# EAGLE design STM32_learning stand (EAGLE 9.5.2)

## Sheet 1 of 2: Питание, микроконтроллер, цифровой и аналоговый ввод, системы измерения
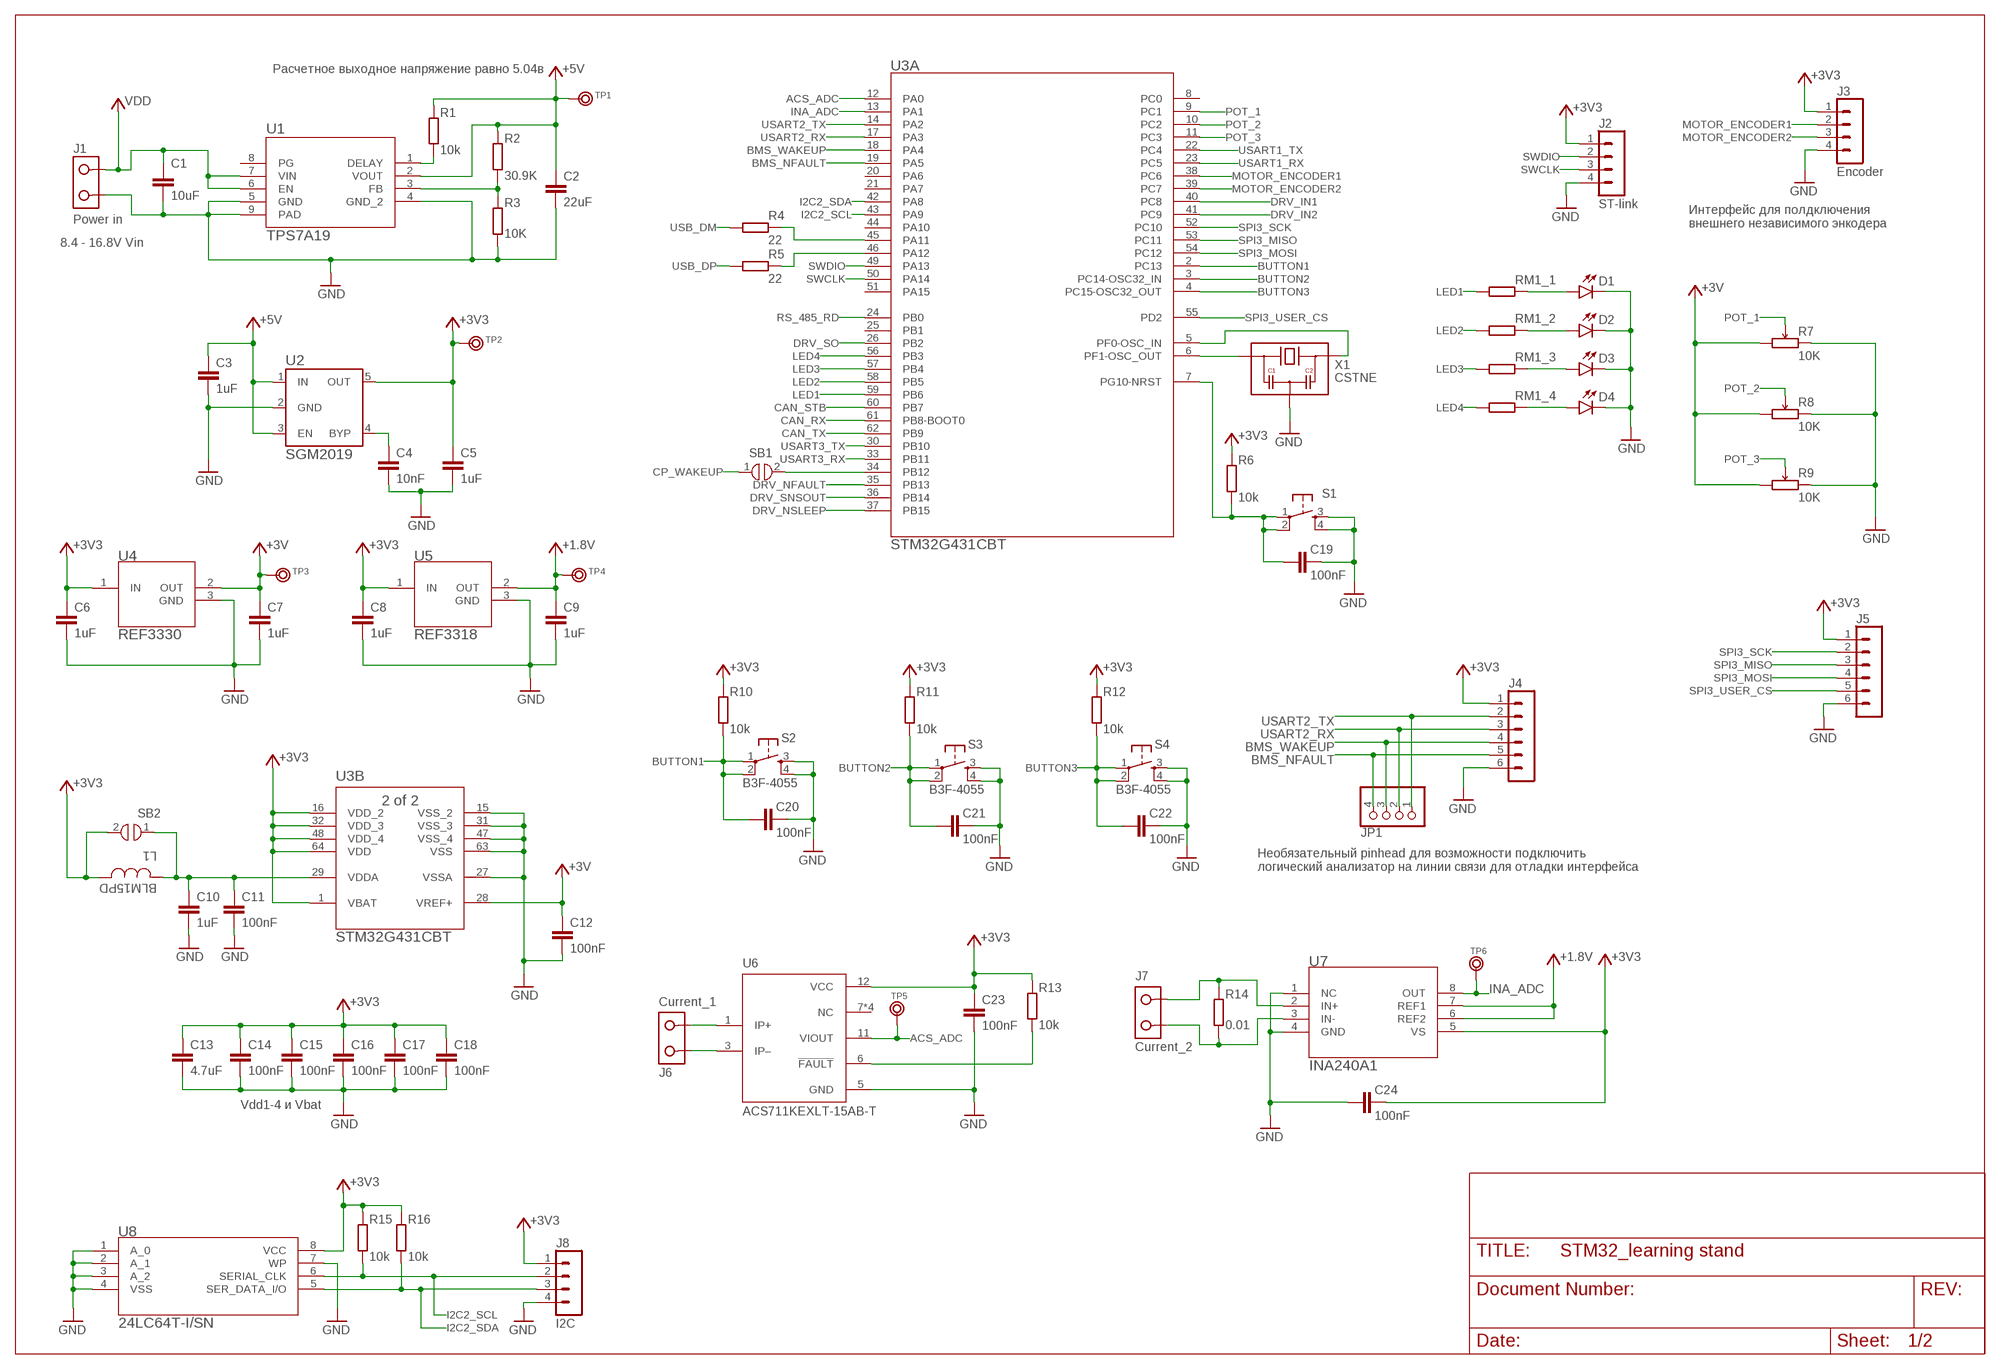
[diagram p0: schematic, sheet 1]

### Parts
C1  10uF  C-EU1206  [C1206]
C2  22uF  C-EU0805  [C0805]
C3  1uF  C-EU0603  [C0603]
C4  10nF  C-EU0402  [C0402]
C5  1uF  C-EU0603  [C0603]
C6  1uF  C-EU0603  [C0603]
C7  1uF  C-EU0603  [C0603]
C8  1uF  C-EU0603  [C0603]
C9  1uF  C-EU0603  [C0603]
C10  1uF  C-EU0603  [C0603]
C11  100nF  C-EU0402  [C0402]
C12  100nF  C-EU0402  [C0402]
C13  4.7uF  C-EU0603  [C0603]
C14  100nF  C-EU0402  [C0402]
C15  100nF  C-EU0402  [C0402]
C16  100nF  C-EU0402  [C0402]
C17  100nF  C-EU0402  [C0402]
C18  100nF  C-EU0402  [C0402]
C19  100nF  C-EU0402  [C0402]
C20  100nF  C-EU0402  [C0402]
C21  100nF  C-EU0402  [C0402]
C22  100nF  C-EU0402  [C0402]
C23  100nF  C-EU0402  [C0402]
C24  100nF  C-EU0402  [C0402]
D1  Blue  LED0805  [LED-0805]
D2  Blue  LED0805  [LED-0805]
D3  Blue  LED0805  [LED-0805]
D4  Blue  LED0805  [LED-0805]
J1  Power in  DG301-2P"  [DG301-2P]
J2  ST-link  S4B-PH-K  [S4B-PH-K]
J3  Encoder  S4B-PH-K  [S4B-PH-K]
J4  BMS_interface  S6B-PH-K  [S6B-PH-K]
J5  S6B-PH-K  [S6B-PH-K]
J6  Current_1  DG301-2P"  [DG301-2P]
J7  Current_2  DG301-2P"  [DG301-2P]
J8  I2C  B4B-PH-K  [B4B-PH-K]
JP1  PINHD-1X4  [1X04]
L1  BLM15PD  0402  [0402]
R1  10k  R-EU0402  [R0402]
R2  30.9K  R-EU0603  [R0603]
R3  10K  R-EU0603  [R0603]
R4  22  R-EU0402  [R0402]
R5  22  R-EU0402  [R0402]
R6  10k  R-EU0402  [R0402]
R7  10K  POTEMTIOMETER_EU  [ALPS_PTM]
R8  10K  POTEMTIOMETER_EU  [ALPS_PTM]
R9  10K  POTEMTIOMETER_EU  [ALPS_PTM]
R10  10k  R-EU0402  [R0402]
R11  10k  R-EU0402  [R0402]
R12  10k  R-EU0402  [R0402]
R13  10k  R-EU0402  [R0402]
R14  0.01  R_EU_CS  [CS_R0805]
R15  10k  R-EU0402  [R0402]
R16  10k  R-EU0402  [R0402]
RM1  RES_ARRAY  [0603-ARC]
S1  MOMENTARY-SWITCH-SPST-2-[SMD-5.2MM]  [TACTILE_SWITCH_SMD_5.2MM]
S2  B3F-4055  [SWITCH_B3F-4055]
S3  B3F-4055  [SWITCH_B3F-4055]
S4  B3F-4055  [SWITCH_B3F-4055]
SB1  SOLDER_BRIDGE  [SOLDER_BRIDGE]
SB2  SOLDER_BRIDGE  [SOLDER_BRIDGE]
TP1  TEST_RING  [TEST_RING]
TP2  TEST_RING  [TEST_RING]
TP3  TEST_RING  [TEST_RING]
TP4  TEST_RING  [TEST_RING]
TP5  TEST_RING  [TEST_RING]
TP6  TEST_RING  [TEST_RING]
U1  TPS7A19  TPS7A1901DRBT  [DRB0008B]
U2  SGM2019  [SOT23-5]
U3  STM32G431CBT  STM32G4_LQFP64  [LQFP64-10X10MM]
U4  REF3330  REF33  [SOT-23-3]
U5  REF3318  REF33  [SOT-23-3]
U6  ACS711KEXLT-15AB-T  [SENSOR_ACS711KEXLT-15AB-T]
U7  INA240A1  INA240_TSSOP  [TSSOP-8]
U8  24LC64T-I/SN  SOIC8_I2C_SMALL  [SOIC8]
X1  CSTNE  [MURATA_SMD_3P]

### Nets
+1.8V: C9.2 TP4.1 U5.2(OUT) U7.6(REF2) U7.7(REF1)
+3V: C7.2 C12.1 R7.P$1 R8.P$1 R9.P$1 TP3.1 U3.28(B:VREF+) U4.2(OUT)
+3V3: C5.2 C6.2 C8.2 C13.2 C14.1 C15.1 C16.1 C17.1 C18.1 C23.1 C24.2 J2.1 J3.1 J4.1 J5.1 J8.1 L1.2 R6.2 R10.2 R11.2 R12.2 R13.2 R15.2 R16.2 SB2.2 TP2.1 U2.5(OUT) U3.1(B:VBAT) U3.16(B:VDD_2) U3.32(B:VDD_3) U3.48(B:VDD_4) U3.64(B:VDD) U4.1(IN) U5.1(IN) U6.12(VCC) U7.5(VS) U8.8(VCC) ; also sheet 2
+5V: C2.1 C3.2 R1.2 R2.2 TP1.1 U1.2(VOUT) U2.1(IN) U2.3(EN) ; also sheet 2
ACS_ADC: TP5.1 U3.12(A:PA0) U6.11(VIOUT)
ACS_IP+: J6.1 U6.1(IP+)
ACS_IP-: J6.2 U6.3(IP–)
BMS_NFAULT: J4.5 JP1.4 U3.19(A:PA5)
BMS_WAKEUP: J4.4 JP1.3 U3.18(A:PA4)
BUTTON1: C20.1 R10.1 S2.1 S2.2 U3.2(A:PC13)
BUTTON2: C21.1 R11.1 S3.1 S3.2 U3.3(A:PC14-OSC32_IN)
BUTTON3: C22.1 R12.1 S4.1 S4.2 U3.4(A:PC15-OSC32_OUT)
CAN_RX: U3.61(A:PB8-BOOT0) ; also sheet 2
CAN_STB: U3.60(A:PB7) ; also sheet 2
CAN_TX: U3.62(A:PB9) ; also sheet 2
CP_WAKEUP: SB1.1 ; also sheet 2
DRV_IN1: U3.40(A:PC8) ; also sheet 2
DRV_IN2: U3.41(A:PC9) ; also sheet 2
DRV_NFAULT: U3.35(A:PB13) ; also sheet 2
DRV_NSLEEP: U3.37(A:PB15) ; also sheet 2
DRV_SNSOUT: U3.36(A:PB14) ; also sheet 2
DRV_SO: U3.26(A:PB2) ; also sheet 2
GND: C1.2 C2.2 C3.1 C4.2 C5.1 C6.1 C7.1 C8.1 C9.1 C10.1 C11.2 C12.2 C13.1 C14.2 C15.2 C16.2 C17.2 C18.2 C19.2 C20.2 C21.2 C22.2 C23.2 C24.1 D1.-(C) D2.-(C) D3.-(C) D4.-(C) J1.1 J2.4 J3.4 J4.6 J5.6 J8.4 R3.1 R7.P$3 R8.P$3 R9.P$3 S1.3 S1.4 S2.3 S2.4 S3.3 S3.4 S4.3 S4.4 U1.4(GND_2) U1.5(GND) U1.9(PAD) U2.2(GND) U3.15(B:VSS_2) U3.27(B:VSSA) U3.31(B:VSS_3) U3.47(B:VSS_4) U3.63(B:VSS) U4.3(GND) U5.3(GND) U6.5(GND) U7.1(NC) U7.4(GND) U8.1(A_0) U8.2(A_1) U8.3(A_2) U8.4(VSS) U8.7(WP) X1.2(GND) ; also sheet 2
I2C2_SCL: J8.2 R15.1 U3.43(A:PA9) U8.6(SERIAL_CLK)
I2C2_SDA: J8.3 R16.1 U3.42(A:PA8) U8.5(SER_DATA_I/O)
INA_ADC: TP6.1 U3.13(A:PA1) U7.8(OUT)
LED1: RM1.1 U3.59(A:PB6)
LED2: RM1.2 U3.58(A:PB5)
LED3: RM1.3 U3.57(A:PB4)
LED4: RM1.4 U3.56(A:PB3)
MOTOR_ENCODER1: J3.2 U3.38(A:PC6)
MOTOR_ENCODER2: J3.3 U3.39(A:PC7)
N$2: D4.+(A) RM1.5
N$3: SB1.2 U3.34(A:PB12)
N$4: C4.1 U2.4(BYP)
N$9: D3.+(A) RM1.6
N$12: R4.2 U3.45(A:PA11)
N$13: R5.2 U3.46(A:PA12)
N$14: D2.+(A) RM1.7
N$15: D1.+(A) RM1.8
N$16: U3.6(A:PF1-OSC_OUT) X1.1(IN)
N$17: U3.5(A:PF0-OSC_IN) X1.3(OUT)
N$18: C19.1 R6.1 S1.1 S1.2 U3.7(A:PG10-NRST)
N$21: R2.1 R3.2 U1.3(FB)
N$22: R1.1 U1.1(DELAY)
N$23: R13.1 U6.6(!FAULT)
N$25: J7.1 R14.2 U7.2(IN+)
N$28: J7.2 R14.1 U7.3(IN-)
POT_1: R7.P$2 U3.9(A:PC1)
POT_2: R8.P$2 U3.10(A:PC2)
POT_3: R9.P$2 U3.11(A:PC3)
RS_485_RD: U3.24(A:PB0) ; also sheet 2
SPI3_MISO: J5.3 U3.53(A:PC11)
SPI3_MOSI: J5.4 U3.54(A:PC12)
SPI3_SCK: J5.2 U3.52(A:PC10)
SPI3_USER_CS: J5.5 U3.55(A:PD2)
SWCLK: J2.3 U3.50(A:PA14)
SWDIO: J2.2 U3.49(A:PA13)
USART1_RX: U3.23(A:PC5) ; also sheet 2
USART1_TX: U3.22(A:PC4) ; also sheet 2
USART2_RX: J4.3 JP1.2 U3.17(A:PA3)
USART2_TX: J4.2 JP1.1 U3.14(A:PA2)
USART3_RX: U3.33(A:PB11) ; also sheet 2
USART3_TX: U3.30(A:PB10) ; also sheet 2
USB_DM: R4.1 ; also sheet 2
USB_DP: R5.1 ; also sheet 2
VDD: C1.1 J1.2 U1.6(EN) U1.7(VIN) ; also sheet 2
VDDA: C10.2 C11.1 L1.1 SB2.1 U3.29(B:VDDA)
Unconnected: U1.8(PG) U3.8(A:PC0) U3.20(A:PA6) U3.21(A:PA7) U3.25(A:PB1) U3.44(A:PA10) U3.51(A:PA15) U6.7(NC) U6.8(NC) U6.9(NC) U6.10(NC)

### Notes on the sheet
- Расчетное выходное напряжение равно 5.04в
- Интерфейс для полдключения
  внешнего независимого энкодера
- 8.4 - 16.8V Vin
- Необязательный pinhead для возможности подключить
  логический анализатор на линии связи для отладки интерфейса
- Vdd1-4 и Vbat

## Sheet 2 of 2: Интерфейсы связи и драйвер двигателя
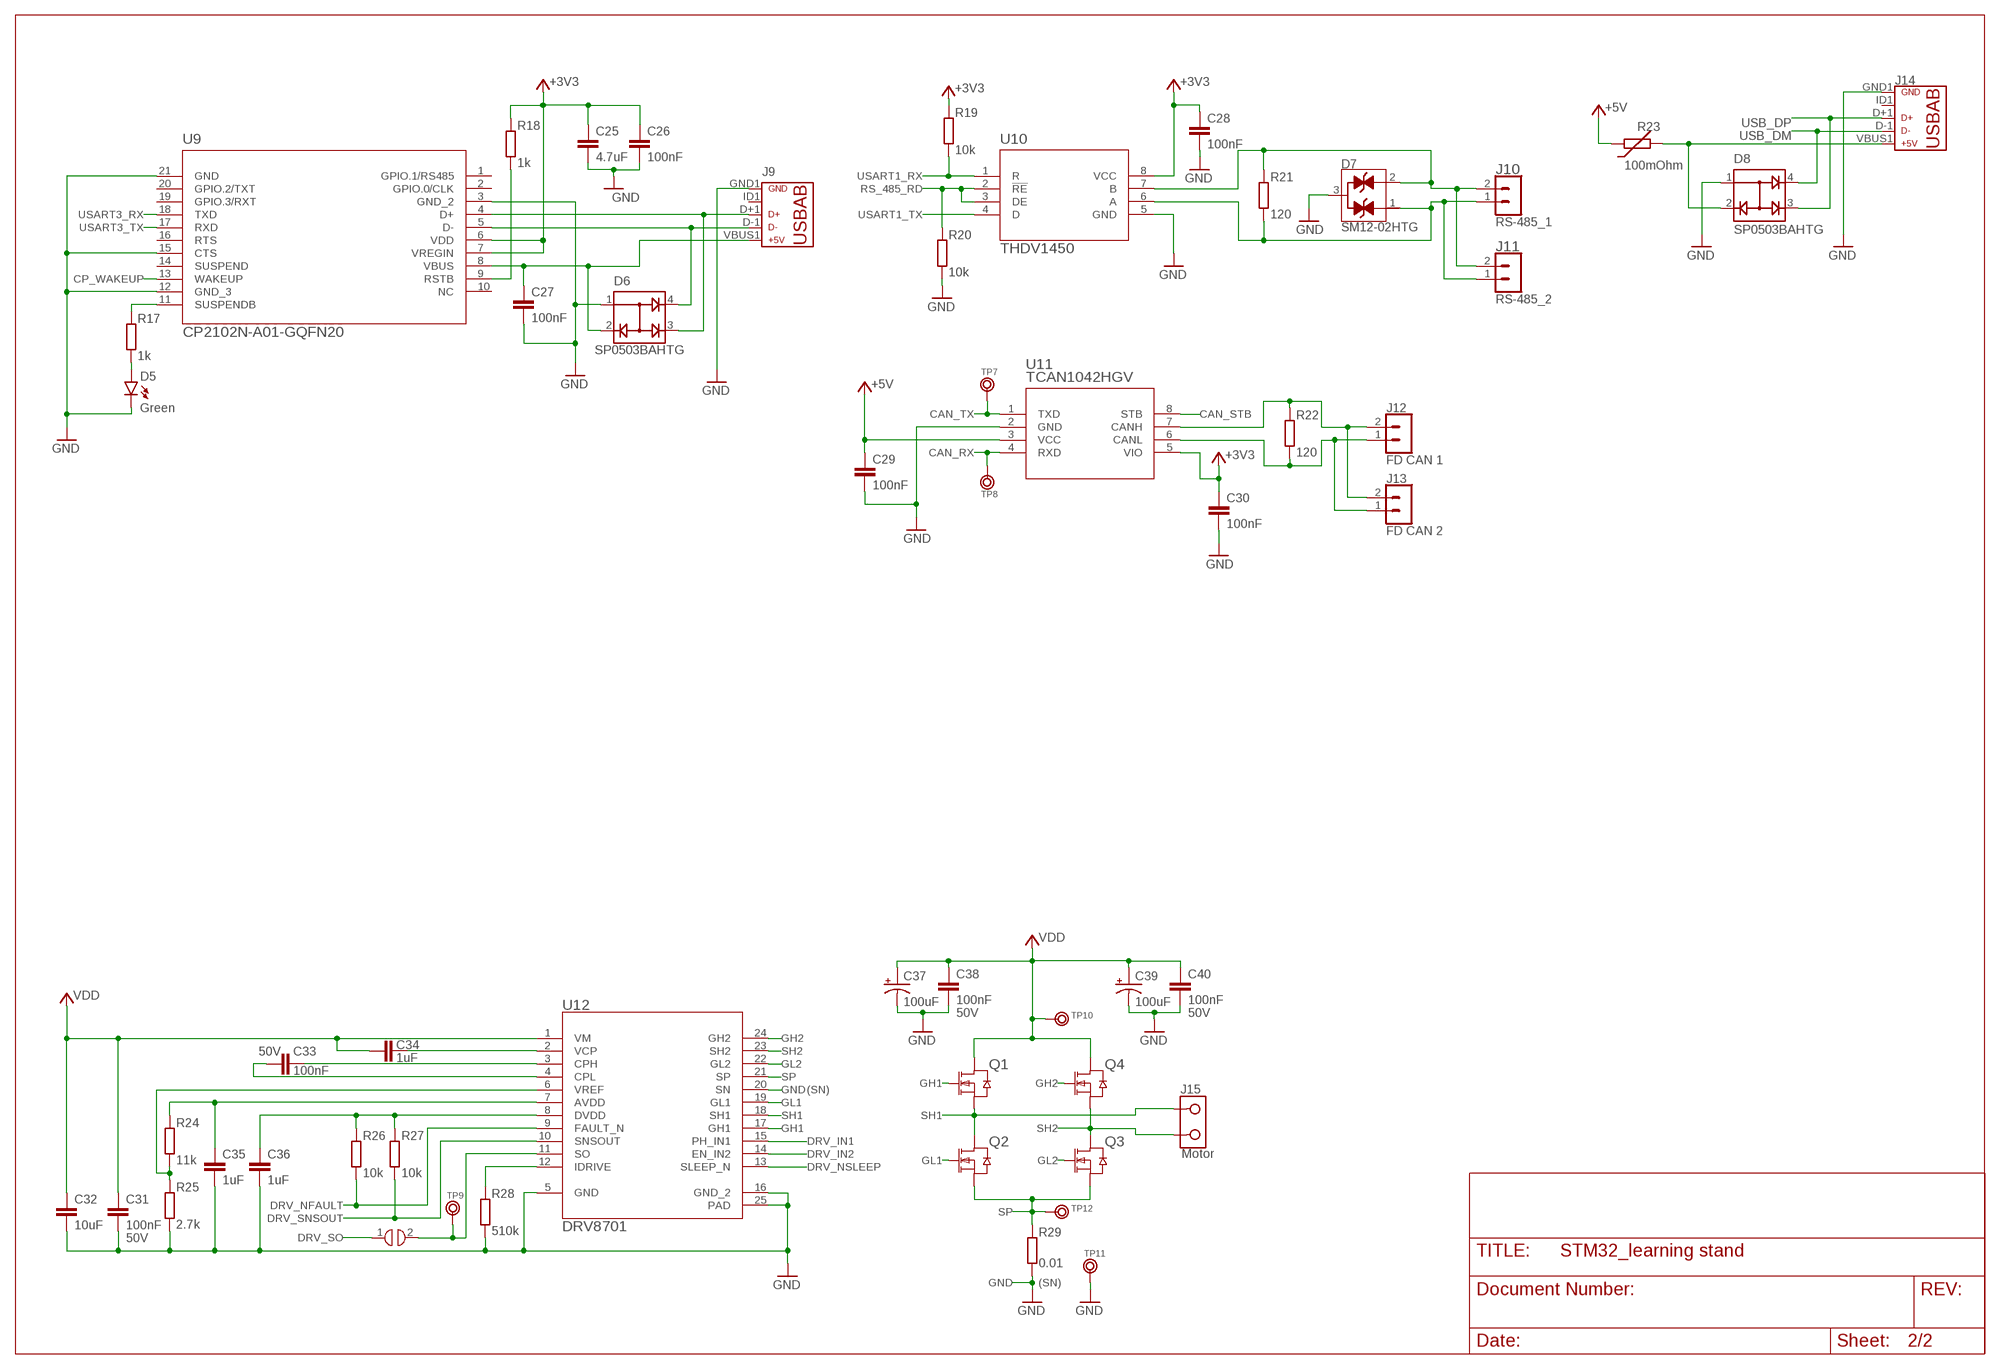
[diagram p1: schematic, sheet 2]

### Parts
C25  4.7uF  C-EU0603  [C0603]
C26  100nF  C-EU0402  [C0402]
C27  100nF  C-EU0402  [C0402]
C28  100nF  C-EU0402  [C0402]
C29  100nF  C-EU0402  [C0402]
C30  100nF  C-EU0402  [C0402]
C31  100nF  C-EU-CERAMIC0603  [C0603]
C32  10uF  C-EU1206  [C1206]
C33  100nF  C-EU-CERAMIC0603  [C0603]
C34  1uF  C-EU0603  [C0603]
C35  1uF  C-EU0603  [C0603]
C36  1uF  C-EU0603  [C0603]
C37  100uF  C-EU-ELECTROLYTIC-6.3X7.7  [6.3X7.7]
C38  100nF  C-EU-CERAMIC0603  [C0603]
C39  100uF  C-EU-ELECTROLYTIC-6.3X7.7  [6.3X7.7]
C40  100nF  C-EU-CERAMIC0603  [C0603]
D5  Green  LED0805  [LED-0805]
D6  SP0503BAHTG  [SOT143]
D7  SM12-02HTG  SOT_23_TVS  [SOT23]
D8  SP0503BAHTG  [SOT143]
J9  USB_MICRO""  [USB-MICRO-SMD]
J10  RS-485_1  S2B-PH-K  [S2B-PH-K]
J11  RS-485_2  S2B-PH-K  [S2B-PH-K]
J12  FD CAN 1  S2B-PH-K  [S2B-PH-K]
J13  FD CAN 2  S2B-PH-K  [S2B-PH-K]
J14  USB_MICRO""  [USB-MICRO-SMD]
J15  Motor  DG301-2P"  [DG301-2P]
Q1  SON5X6_MOSFET  [SON5X6]
Q2  SON5X6_MOSFET  [SON5X6]
Q3  SON5X6_MOSFET  [SON5X6]
Q4  SON5X6_MOSFET  [SON5X6]
R17  1k  R-EU0402  [R0402]
R18  1k  R-EU0402  [R0402]
R19  10k  R-EU0402  [R0402]
R20  10k  R-EU0402  [R0402]
R21  120  R-EU0805  [R0805]
R22  120  R-EU0805  [R0805]
R23  100mOhm  PTC_FUSE-0805  [0805_PTC_FUSE]
R24  11k  R-EU0402  [R0402]
R25  2.7k  R-EU0402  [R0402]
R26  10k  R-EU0402  [R0402]
R27  10k  R-EU0402  [R0402]
R28  510k  R-EU0402  [R0402]
R29  0.01  R_EU_CS  [CS_R0805]
SB3  SOLDER_BRIDGE  [SOLDER_BRIDGE]
TP7  TEST_RING  [TEST_RING]
TP8  TEST_RING  [TEST_RING]
TP9  TEST_RING  [TEST_RING]
TP10  TEST_RING  [TEST_RING]
TP11  TEST_RING  [TEST_RING]
TP12  TEST_RING  [TEST_RING]
U9  CP2102N-A01-GQFN20  [QFN20C_3X3]
U10  THDV1450  RS485_S8  [SOIC8]
U11  TCAN1042HGV  8_PIN_CAN_TRANSIVERSTB_VIO  [SOIC_8]
U12  DRV8701  [VQFN-24]

### Nets
+3V3: C25.2 C26.1 C28.1 C30.1 R18.2 R19.2 U9.6(VDD) U9.7(VREGIN) U10.8(VCC) U11.5(VIO) ; also sheet 1
+5V: C29.1 R23.1 U11.3(VCC) ; also sheet 1
CAN_RX: TP8.1 U11.4(RXD) ; also sheet 1
CAN_STB: U11.8(STB) ; also sheet 1
CAN_TX: TP7.1 U11.1(TXD) ; also sheet 1
CANH: J12.2 J13.2 R22.1 U11.7(CANH)
CANL: J12.1 J13.1 R22.2 U11.6(CANL)
CP_WAKEUP: U9.13(WAKEUP) ; also sheet 1
DRV_IN1: U12.15(PH_IN1) ; also sheet 1
DRV_IN2: U12.14(EN_IN2) ; also sheet 1
DRV_NFAULT: R26.1 U12.9(FAULT_N) ; also sheet 1
DRV_NSLEEP: U12.13(SLEEP_N) ; also sheet 1
DRV_SNSOUT: R27.1 U12.10(SNSOUT) ; also sheet 1
DRV_SO: SB3.1 ; also sheet 1
GH1: Q1.4(G) U12.17(GH1)
GH2: Q4.4(G) U12.24(GH2)
GL1: Q2.4(G) U12.19(GL1)
GL2: Q3.4(G) U12.22(GL2)
GND: C25.1 C26.2 C27.2 C28.2 C29.2 C30.2 C31.2 C32.2 C35.1 C36.1 C37.2(-) C38.2 C39.2(-) C40.2 D5.-(C) D6.1 D7.3 D8.1 J9.GND1(GND) J14.GND1(GND) R20.1 R25.1 R28.1 R29.1 TP11.1 U9.3(GND_2) U9.12(GND_3) U9.15(CTS) U9.21(GND) U10.5(GND) U11.2(GND) U12.5(GND) U12.16(GND_2) U12.20(SN) U12.25(PAD) ; also sheet 1
N$1: D6.3 J9.D+1(D+) U9.4(D+)
N$5: D6.4 J9.D-1(D-) U9.5(D-)
N$6: C27.1 D6.2 J9.VBUS1(VBUS) U9.8(VBUS)
N$7: R17.2 U9.11(SUSPENDB)
N$8: R18.1 U9.9(RSTB)
N$10: D5.+(A) R17.1
N$11: D8.2 J14.VBUS1(VBUS) R23.2
N$19: D7.2 J10.2 J11.2 R21.2 U10.7(B)
N$20: D7.1 J10.1 J11.1 R21.1 U10.6(A)
N$24: C33.1 U12.3(CPH)
N$29: SB3.2 TP9.1 U12.11(SO)
N$32: C33.2 U12.4(CPL)
N$33: C34.2 U12.2(VCP)
N$34: R24.1 R25.2 U12.6(VREF)
N$35: C35.2 R24.2 U12.7(AVDD)
N$36: C36.2 R26.2 R27.2 U12.8(DVDD)
N$37: R28.2 U12.12(IDRIVE)
RS_485_RD: R20.2 U10.2(!RE) U10.3(DE) ; also sheet 1
SH1: J15.1 Q1.1(S) Q1.2(S) Q1.3(S) Q2.5(D) Q2.6(D) Q2.7(D) Q2.8(D) Q2.9(D) U12.18(SH1)
SH2: J15.2 Q3.5(D) Q3.6(D) Q3.7(D) Q3.8(D) Q3.9(D) Q4.1(S) Q4.2(S) Q4.3(S) U12.23(SH2)
SP: Q2.1(S) Q2.2(S) Q2.3(S) Q3.1(S) Q3.2(S) Q3.3(S) R29.2 TP12.1 U12.21(SP)
USART1_RX: R19.1 U10.1(R) ; also sheet 1
USART1_TX: U10.4(D) ; also sheet 1
USART3_RX: U9.18(TXD) ; also sheet 1
USART3_TX: U9.17(RXD) ; also sheet 1
USB_DM: D8.4 J14.D-1(D-) ; also sheet 1
USB_DP: D8.3 J14.D+1(D+) ; also sheet 1
VDD: C31.1 C32.1 C34.1 C37.1(+) C38.1 C39.1(+) C40.1 Q1.5(D) Q1.6(D) Q1.7(D) Q1.8(D) Q1.9(D) Q4.5(D) Q4.6(D) Q4.7(D) Q4.8(D) Q4.9(D) TP10.1 U12.1(VM) ; also sheet 1
Unconnected: J9.ID1(USBID) J14.ID1(USBID) U9.1(GPIO.1/RS485) U9.2(GPIO.0/CLK) U9.10(NC) U9.14(SUSPEND) U9.16(RTS) U9.19(GPIO.3/RXT) U9.20(GPIO.2/TXT)

### Notes on the sheet
- 50V | 50V
- 50V
- (SN)
- 50V
- (SN)

## Library data of the parts
C1-C30 C32 C34-C36 = Capacitors:C-EU
C31 C33 C38 C40 = Capacitors:C-EU-CERAMIC
C37 C39 = Capacitors:C-EU-ELECTROLYTIC; BUILT_BY: EMA_Cory; COPYRIGHT: Copyright (C) 2018 Accelerated Designs. All rights reserved; MANUFACTURER_PART_NUMBER: EEE-1VA100WAR; VENDOR: Panasonic
D1-D5 = Semiconductor_devices:LED0805: LED Model suitable for all 0805 leds Updated: 22.10.19 by Andrey Dovnar, andrevdovnar@gmail.com
D6 D8 = Semiconductor_devices:SP0503BAHTG: TVS DIODE 5.5VWM 8.5VC SOT143 Model suitable for SP0503BAHTG Updated: 30.01.20 by Andrey Dovnar, andrevdovnar@gmail.com; DESCRIPTION: 8.5V Clamp Ipp Tvs Diode Surface Mount SOT-143-4; DIGI-KEY_PART_NUMBER: F2715CT-ND; DIGI-KEY_PURCHASE_URL: https://www.digikey.com/product-detail/en/littelfuse-inc/SP0503BAHTG/F2715CT-ND/1154322?utm_source=snapeda&utm_medium=aggregator&utm_campaign=symbol; MF: Littelfuse Inc.; MP: SP0503BAHTG; PACKAGE: SOT-143 Littelfuse
D7 = Semiconductor_devices:SOT_23_TVS; SUITTABLE_FOR: SM12-02HTG
J1 J6 J7 J15 = Terminal blocks:DG301-2P
J2 J3 = con-jst-ph:S4B-PH-K: Wire to board connector Model suitable for S4B-PH-K Updated: 21.10.19 by Andrey Dovnar, andrevdovnar@gmail.com
J4 J5 = con-jst-ph:S6B-PH-K: Wire to board connector Model suitable for S6B-PH-K Updated: 21.10.19 by Andrey Dovnar, andrevdovnar@gmail.com
J8 = con-jst-ph:B4B-PH-K: Wire to board connector Model suitable for B4B-PH-K Updated: 21.10.19 by Andrey Dovnar, andrevdovnar@gmail.com
J9 J14 = USB:USB_MICRO: This is a USB AB connector that is compatible with USB OTG. i.e. this connector can serve as a host or device
J10-J13 = con-jst-ph:S2B-PH-K: Wire to board connector Model suitable for S2B-PH-K Updated: 21.10.19 by Andrey Dovnar, andrevdovnar@gmail.com
JP1 = commonly used connectors:PINHD-1X4: PIN HEADER
L1 = Inductors:0402; BUILT_BY: EMA_UL_Team; MANUFACTURER_PART_NUMBER: BLM15PD121SN1D; VENDOR: Murata
Q1-Q4 = Transistors:SON5X6_MOSFET: Suitable for TI csd185**Q5A MOSFETs; BUILT_BY: EMA_UL_Team; MANUFACTURER_PART_NUMBER: CSD18534Q5A; VENDOR: Texas Instruments
R1-R6 R10-R13 R15-R22 R24-R28 = Resistors:R-EU
R7-R9 = Resistors:POTEMTIOMETER_EU
R14 R29 = Resistors:R_EU_CS
R23 = Fuses:PTC_FUSE: PTC FUSE Model suitable for 0805L0 littelFuse fuses Created: 30.01.20 by Andrey Dovnar, andrevdovnar@gmail.com
RM1 = Resistors:RES_ARRAY
S1 = buttons and switches:MOMENTARY-SWITCH-SPST-2: Smd buttom Updated: 16.11.19 by Andrey Dovnar, andrevdovnar@gmail.com; PROD_ID: SWCH-08247; SF_SKU: COM-08720
S2-S4 = buttons and switches:B3F-4055; BUILT_BY: EMA_Cory; COPYRIGHT: Copyright (C) 2018 Accelerated Designs. All rights reserved; MANUFACTURER_PART_NUMBER: B3F-4055; VENDOR: Omron
SB1-SB3 = testing:SOLDER_BRIDGE
TP1-TP12 = testing:TEST_RING: Test rings are used to fixing multimeter probe and doing measurements hands-free Updated: 02.01.2020 by Denis Yaskevich, denis.jaskevich@yandex.by
U1 = LDOs:TPS7A1901DRBT; BUILT_BY: EMA_UL_Team; COPYRIGHT: Copyright (C) 2018 Accelerated Designs. All rights reserved; MANUFACTURER_PART_NUMBER: TPS7A1901DRBT; VENDOR: Texas Instruments
U2 = LDOs:SGM2019: VOLTAGE REGULATOR
U3 = stmicroelectronics:STM32G4_LQFP64: MCU Model suitable for STM32G431R(6/8/B)T(3/6) Created: 28.01.20 by Andrey Dovnar, andrevdovnar@gmail.com; BUILT_BY: EMA_Jessica; COPYRIGHT: Copyright (C) 2016 Accelerated Designs. All rights reserved; MANUFACTURER_PART_NUMBER: STM32G4_LQFP64_T1; VENDOR: STMicroelectronics
U4 U5 = Voltage references:REF33; BUILT_BY: EMA_UL_Team; MANUFACTURER: Texas Instruments; MANUFACTURER_PART_NUMBER: REF3318AIDCKR; VENDOR: Texas Instruments
U6 = Current sensing:ACS711KEXLT-15AB-T: Hall Effect Linear Current Sensor Model suitable for all Allegro current sensors in qfn packages Overcurrent Fault Output for less than 100 V Isolation Applications Updated: 22.10.19 by Andrey Dovnar, andrevdovnar@gmail.com; AVAILABILITY: Unavailable; DESCRIPTION: Current Sensor 15.5A 1 Channel Hall Effect, Open Loop Bidirectional 12-PowerWFQFN; MF: Allegro MicroSystems LLC; MP: ACS711KEXLT-15AB-T; PACKAGE: PowerWFQFN-12 Allegro MicroSystems LLC; PRICE: None
U7 = Current sensing:INA240_TSSOP
U8 = EEPROM:SOIC8_I2C_SMALL: Model suiutabe for MICROCHIP 24LC64; BUILT_BY: EMA_UL_Team; MANUFACTURER_PART_NUMBER: 24LC64T-I/SN; VENDOR: Microchip
U9 = Silicon labs:CP2102N-A01-GQFN20; COPYRIGHT: Copyright (C) 2016 Accelerated Designs. All rights reserved; MANUFACTURER_PART_NUMBER: CP2102N-A01-GQFN20; VENDOR: Silicon Labs
U10 = Interfaces:RS485_S8; SUITABLE_FOR: thvd1450D
U11 = texas Instrumets:8_PIN_CAN_TRANSIVER: Universal 8-pin CAN-transiver device Model suitable for all TI 9-pin CAN transivers Variant with STB_VIO is suitabel for: TCAN1042 with (H), (HG), (GV) and (HGV) Created: 28.01.20 by Andrey Dovnar, andrevdovnar@gmail.com
U12 = Transistors drivers:DRV8701: Suitable for TI DRV8701P/(E) : H - driver with 47V max Vin and external MOSFETs
X1 = resonators and oscillators:CSTNE: Ceramic Resonator with integrated load capacitors No external components required Model suitable for all Murata electronics resonators from CSTNE_G, CSTNE_V, CSTNE_VH3L and CSTNE_GH5L families Created: 16.11.19 by Andrey Dovnar, andrevdovnar@gmail.com

## Board
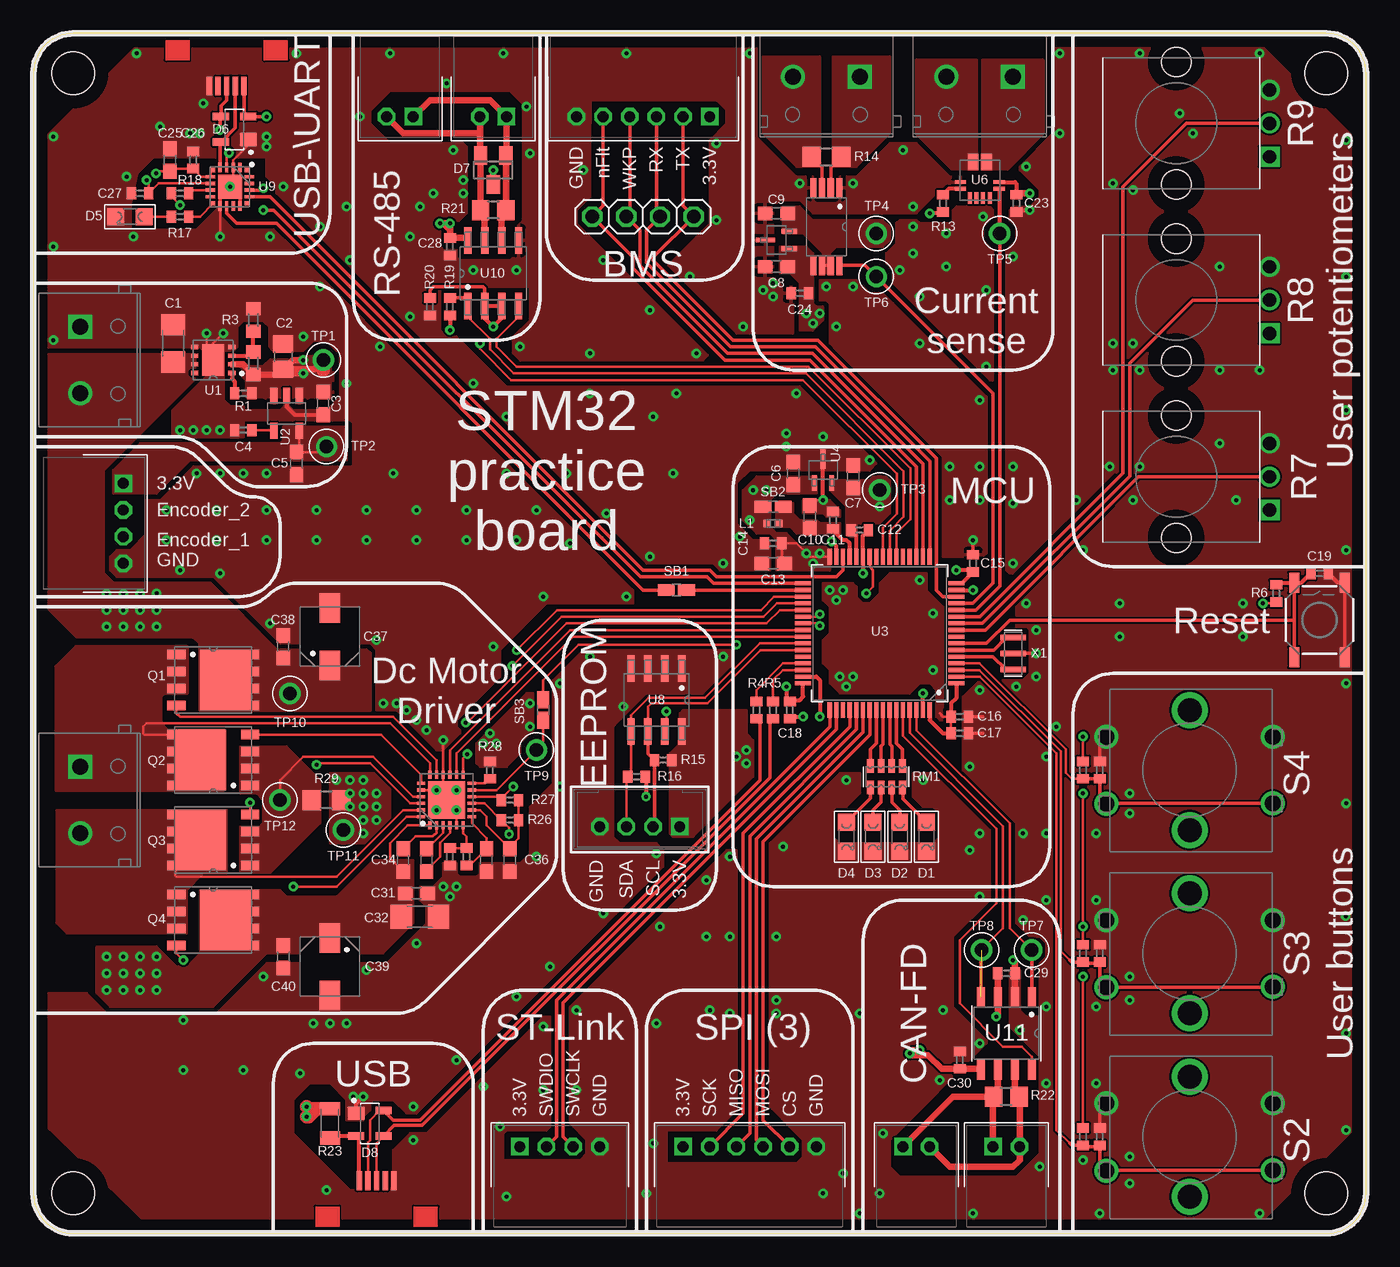
[diagram p2: board, top side]
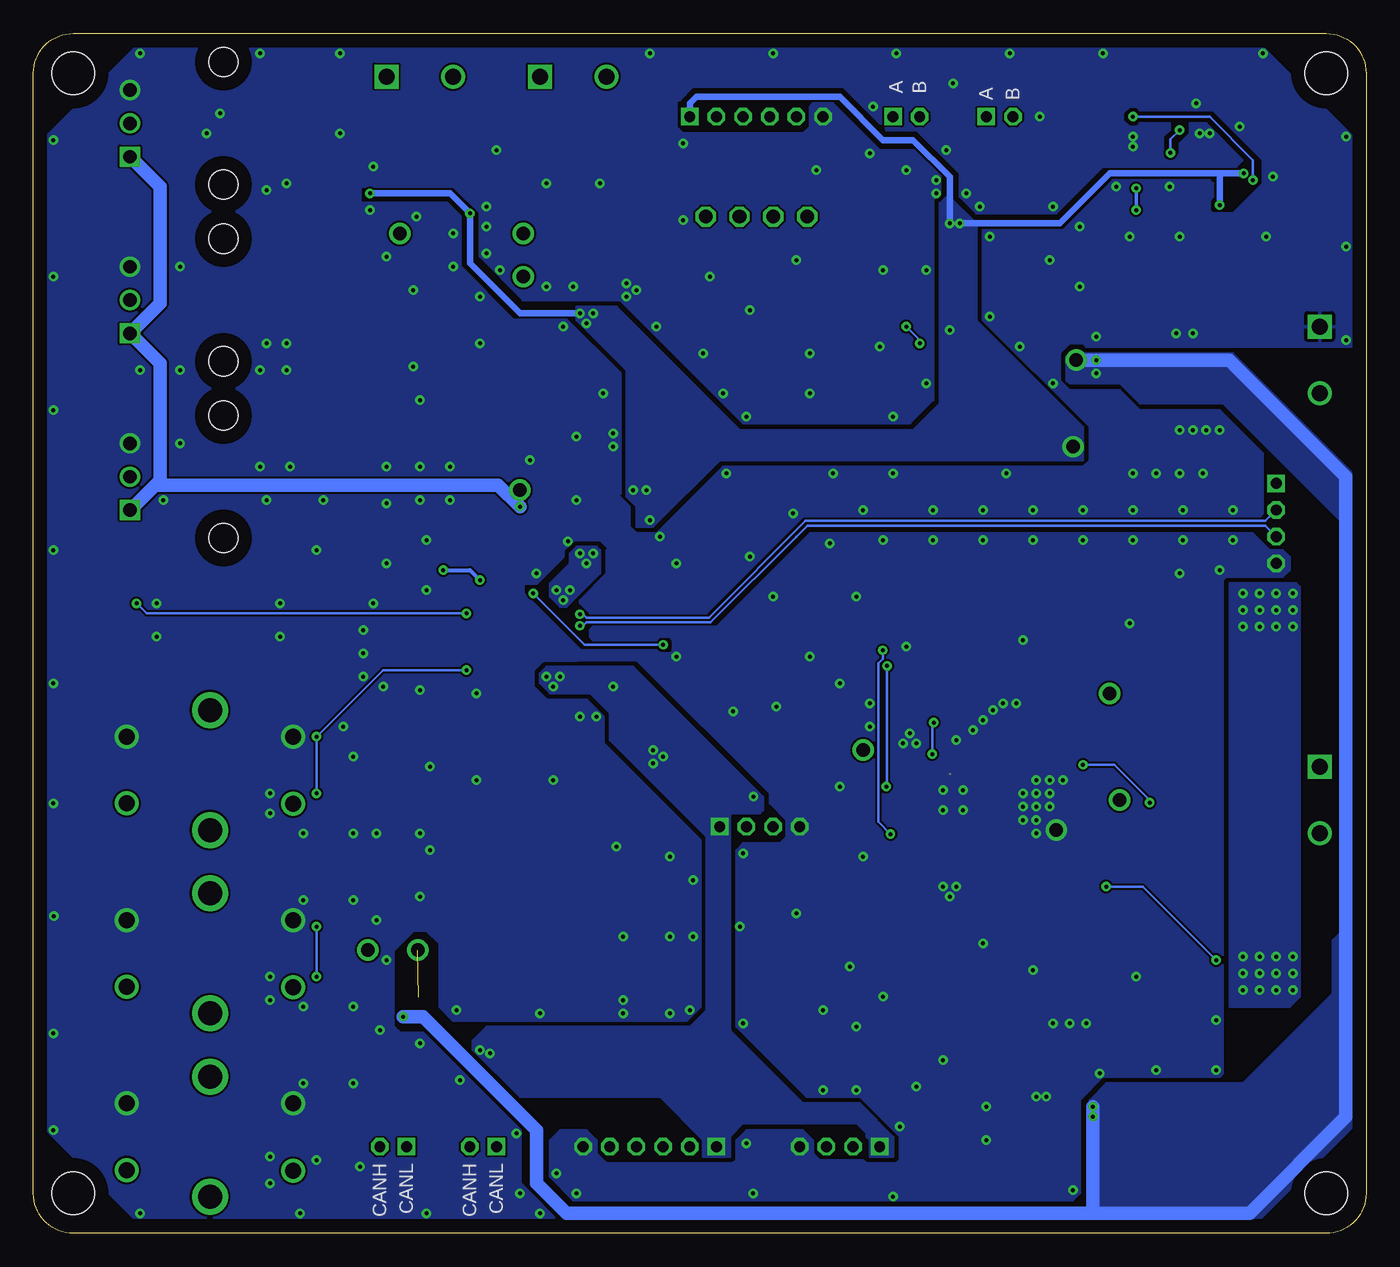
[diagram p3: board, bottom side, seen from below]

Size 100 x 90 mm. Coordinates in mm from the lower left corner, seen from the top.
Outline: 3,0 97,0 arc90 100,3 100,87 arc90 97,90 3,90 arc90 0,87 0,3 arc90 3,0
Copper layers (1*16): Top 0.035mm / dielectric 1.5mm / Bottom 0.035mm
Design rules "default *": minimum track width 6mil, minimum drill 0.3mm, track to track 6mil, track to pad 6mil, pad to pad 6mil, via to via 6mil, smd to smd 6mil, copper to edge 40mil, drill to drill 6mil, minimum pad ring 10mil, minimum via ring 8mil, stop-mask expansion 3mil, vias tented up to drill 20mil, thermal gap 10mil
Holes 3.2 mm at 97,87 97,3 3,3 3,87

### Footprints (pad centres in the part's own frame; a part is rotated, then mirrored left to right if it is on the bottom)
C1206 = smd 1.6 x 1.8: 1 -1.4,0; 2 1.4,0
C0805 = smd 1.3 x 1.5: 1 -0.95,0; 2 0.95,0
C0603 = smd 1.1 x 1: 1 -0.85,0; 2 0.85,0
C0402 = smd 0.7 x 0.9: 1 -0.65,0; 2 0.65,0
6.3X7.7 = smd 2.21 x 1.575: 1 -2.159,0; 2 2.159,0
LED-0805 = smd 1.27 x 1.27: + -1.079,0; - 1.079,0
SOT143 = smd 0.99 x 1.3: 1 -0.76,-1.025 | smd 0.59 x 1.3: 2 0.96,-1.025; 3 0.96,1.025; 4 -0.96,1.025
SOT23 = smd 1 x 1.4: 1 -0.95,-1.1; 2 0.95,-1.1; 3 0,1.1
DG301-2P = drill 1.2 square: 1 -2.5,0 | drill 1.2: 2 2.5,0
S4B-PH-K = drill 0.813 square: 1 -3,0 | drill 0.813 octagon: 2 -1,0; 3 1,0; 4 3,0
S6B-PH-K = drill 0.813 square: 1 -5,0 | drill 0.813 octagon: 2 -3,0; 3 -1,0; 4 1,0; 5 3,0; 6 5,0
B4B-PH-K = drill 0.813 square: 1 -3,0 | drill 0.813 octagon: 2 -1,0; 3 1,0; 4 3,0
USB-MICRO-SMD = smd 1.4 x 0.4: D+1 2.7,0; D-1 2.7,0.65; GND1 2.7,-1.3; ID1 2.7,-0.65; VBUS1 2.7,1.3
S2B-PH-K = drill 0.813 square: 1 -1,0 | drill 0.813 octagon: 2 1,0
1X04 = drill 1.016 octagon: 1 -3.81,0; 2 -1.27,0; 3 1.27,0; 4 3.81,0
0402 = smd 0.559 x 0.559: 1 -0.445,0; 2 0.445,0
SON5X6 = smd 1.372 x 0.71: 1 -2.77,1.905; 2 -2.77,0.635; 3 -2.77,-0.635; 4 -2.77,-1.905 | smd 1.18 x 0.71: 5 2.866,-1.905; 6 2.866,-0.635; 7 2.866,0.635; 8 2.866,1.905 | smd 3.85 x 4.52: 9 0.941,0
R0402 = smd 0.7 x 0.9: 1 -0.65,0; 2 0.65,0
R0603 = smd 1 x 1.1: 1 -0.85,0; 2 0.85,0
ALPS_PTM = drill 1 square: P$1 -2.5,0 | drill 1: P$2 0,0; P$3 2.5,0 | hole 2.2: -4.6,7; 4.6,7
CS_R0805 = smd 1.4 x 1.5: 1 -1.1,0; 2 1.1,0
R0805 = smd 1.3 x 1.5: 1 -0.95,0; 2 0.95,0
0805_PTC_FUSE = smd 1 x 1.5: 1 -1.1,0; 2 1.1,0
0603-ARC = smd 0.5 x 1: 1 -1.2,-0.802; 2 -0.4,-0.802; 3 0.4,-0.802; 4 1.2,-0.802; 5 1.2,0.802; 6 0.4,0.802; 7 -0.4,0.802; 8 -1.2,0.802
TACTILE_SWITCH_SMD_5.2MM = smd 1.524 x 0.762: 1 -2.794,1.905; 2 2.794,1.905; 3 -2.794,-1.905; 4 2.794,-1.905
SWITCH_B3F-4055 = drill 1.2 pad 1.753: 1 6.25,-2.5; 2 -6.25,-2.54; 3 6.25,2.5; 4 -6.25,2.5 | drill 1.8 pad 1.8: 5 0,4.5; 6 0,-4.5
SOLDER_BRIDGE = smd 1.27 x 0.889: 1 -0.762,0; 2 0.762,0
TEST_RING = drill 1.02 pad 1.6: 1 0,0
DRB0008B = smd 0.61 x 0.305: 1 -1.4,0.975; 2 -1.4,0.325; 3 -1.4,-0.325; 4 -1.4,-0.975; 5 1.4,-0.975; 6 1.4,-0.325; 7 1.4,0.325; 8 1.4,0.975 | smd 1.651 x 2.388: 9 0,0
SOT23-5 = smd 0.55 x 1.2: 1 -0.95,-1.3; 2 0,-1.3; 3 0.95,-1.3; 4 0.95,1.3; 5 -0.95,1.3
LQFP64-10X10MM = smd 1.194 x 0.305: 1 -5.75,3.75; 2 -5.75,3.25; 3 -5.75,2.75; 4 -5.75,2.25; 5 -5.75,1.75; 6 -5.75,1.25; 7 -5.75,0.75; 8 -5.75,0.25; 9 -5.75,-0.25; 10 -5.75,-0.75; 11 -5.75,-1.25; 12 -5.75,-1.75; 13 -5.75,-2.25; 14 -5.75,-2.75; 15 -5.75,-3.25; 16 -5.75,-3.75; 33 5.75,-3.75; 34 5.75,-3.25; 35 5.75,-2.75; 36 5.75,-2.25; 37 5.75,-1.75; 38 5.75,-1.25; 39 5.75,-0.75; 40 5.75,-0.25; 41 5.75,0.25; 42 5.75,0.75; 43 5.75,1.25; 44 5.75,1.75; 45 5.75,2.25; 46 5.75,2.75; 47 5.75,3.25; 48 5.75,3.75 | smd 0.305 x 1.194: 17 -3.75,-5.75; 18 -3.25,-5.75; 19 -2.75,-5.75; 20 -2.25,-5.75; 21 -1.75,-5.75; 22 -1.25,-5.75; 23 -0.75,-5.75; 24 -0.25,-5.75; 25 0.25,-5.75; 26 0.75,-5.75; 27 1.25,-5.75; 28 1.75,-5.75; 29 2.25,-5.75; 30 2.75,-5.75; 31 3.25,-5.75; 32 3.75,-5.75; 49 3.75,5.75; 50 3.25,5.75; 51 2.75,5.75; 52 2.25,5.75; 53 1.75,5.75; 54 1.25,5.75; 55 0.75,5.75; 56 0.25,5.75; 57 -0.25,5.75; 58 -0.75,5.75; 59 -1.25,5.75; 60 -1.75,5.75; 61 -2.25,5.75; 62 -2.75,5.75; 63 -3.25,5.75; 64 -3.75,5.75
SOT-23-3 = smd 0.356 x 1.168: 1 -0.65,-0.965; 2 0.65,-0.965 | smd 0.356 x 1.46: 3 0,0.819
SENSOR_ACS711KEXLT-15AB-T = smd 1.27 x 0.8: 1 -1.35,0.5; 3 -1.35,-0.5 | smd 0.3 x 0.85: 5 0.15,-1.45; 6 0.65,-1.45; 11 0.65,1.45; 12 0.15,1.45 | smd 0.85 x 0.3: 7 1.35,-0.75; 8 1.35,-0.25; 9 1.35,0.25; 10 1.35,0.75
TSSOP-8 = smd 1.499 x 0.457: 1 -2.9,0.975; 2 -2.9,0.325; 3 -2.9,-0.325; 4 -2.9,-0.975; 5 2.9,-0.975; 6 2.9,-0.325; 7 2.9,0.325; 8 2.9,0.975
SOIC8 = smd 1.981 x 0.559: 1 -2.362,1.905; 2 -2.362,0.635; 3 -2.362,-0.635; 4 -2.362,-1.905; 5 2.362,-1.905; 6 2.362,-0.635; 7 2.362,0.635; 8 2.362,1.905
QFN20C_3X3 = smd 0.3 x 0.3: 1 -1.25,1.25; 6 -1.25,-1.25; 11 1.25,-1.25; 16 1.25,1.25 | smd 0.705 x 0.25: 2 -1.452,0.75; 3 -1.452,0.25; 4 -1.452,-0.25; 5 -1.452,-0.75; 12 1.452,-0.75; 13 1.452,-0.25; 14 1.452,0.25; 15 1.452,0.75 | smd 0.25 x 0.705: 7 -0.75,-1.452; 8 -0.25,-1.452; 9 0.25,-1.452; 10 0.75,-1.452; 17 0.75,1.452; 18 0.25,1.452; 19 -0.25,1.452; 20 -0.75,1.452 | smd 1.8 x 1.8: 21 0,0
SOIC8' = smd 1.981 x 0.559: 1 -2.464,1.905; 2 -2.464,0.635; 3 -2.464,-0.635; 4 -2.464,-1.905; 5 2.464,-1.905; 6 2.464,-0.635; 7 2.464,0.635; 8 2.464,1.905
SOIC_8 = smd 1.549 x 0.61: 1 -2.7,1.905; 2 -2.7,0.635; 3 -2.7,-0.635; 4 -2.7,-1.905; 5 2.7,-1.905; 6 2.7,-0.635; 7 2.7,0.635; 8 2.7,1.905
VQFN-24 = smd 0.61 x 0.229: 1 -1.9,1.25; 2 -1.9,0.75; 3 -1.9,0.25; 4 -1.9,-0.25; 5 -1.9,-0.75; 6 -1.9,-1.25; 13 1.9,-1.25; 14 1.9,-0.75; 15 1.9,-0.25; 16 1.9,0.25; 17 1.9,0.75; 18 1.9,1.25 | smd 0.229 x 0.61: 7 -1.25,-1.9; 8 -0.75,-1.9; 9 -0.25,-1.9; 10 0.25,-1.9; 11 0.75,-1.9; 12 1.25,-1.9; 19 1.25,1.9; 20 0.75,1.9; 21 0.25,1.9; 22 -0.25,1.9; 23 -0.75,1.9; 24 -1.25,1.9 | smd 2.794 x 2.794: 25 0,0
MURATA_SMD_3P = smd 0.4 x 1.9: 1 -1.2,0; 2 0,0; 3 1.2,0

### Placement (x,y rotation side)
C1  10.5,66.75 90 top
C2  18.75,65.75 90 top
C3  21.75,62.25 90 top
C4  15.75,60.25 180 top
C5  19.75,57.75 90 top
C6  57,57 270 top
C7  61.5,56.75 270 top
C8  55.75,72.5 0 top
C9  55.75,76.5 0 top
C10  58.25,53.75 270 top
C11  60,53.5 90 top
C12  62,52.75 0 top
C13  55.5,50.25 0 top
C14  55.5,51.75 180 top
C15  70.5,50.25 90 top
C16  69.5,38.75 0 top
C17  69.5,37.5 0 top
C18  56.75,39.25 270 top
C19  96.5,49.5 0 top
C20  80,7.25 90 top
C21  80,21 90 top
C22  80,34.75 90 top
C23  73.75,77.25 270 top
C24  57.5,70.5 0 top
C25  10.25,80.5 270 top
C26  12,80.5 90 top
C27  8,78 180 top
C28  31.25,74 270 top
C29  73,19.5 0 top
C30  69.5,13 90 top
C31  28.75,25.5 0 top
C32  29,23.75 0 top
C33  29.5,28 270 top
C34  27.75,28 90 top
C35  34,28 90 top
C36  35.75,28 90 top
C37  22.25,44.75 90 top
C38  18.75,44 90 top
C39  22.25,20 270 top
C40  18.75,20.75 270 top
D1  67,29.75 270 top
D2  65,29.75 270 top
D3  63,29.75 270 top
D4  61,29.75 270 top
D5  7.25,76.25 180 top
D6  15.1,82.8 90 top
D7  34.5,79.75 180 top
D8  25.25,8.25 270 top
J1  3.5,65.5 270 top
J2  39.5,6.5 0 top
J3  6.75,53.25 270 top
J4  45.75,83.75 180 top
J5  53.75,6.5 0 top
J6  71,86.75 180 top
J7  59.5,86.75 180 top
J8  45.5,30.5 180 top
J9  14.5,88.75 270 top
J10  27.5,83.75 180 top
J11  34.5,83.75 180 top
J12  66.25,6.5 0 top
J13  73,6.5 0 top
J14  25.75,1.25 90 top
J15  3.5,32.5 270 top
JP1  45.75,76.25 180 top
L1  55.5,53.25 180 top
Q1  13.5,41.5 0 top
Q2  13.5,35.5 180 top
Q3  13.5,29.5 180 top
Q4  13.5,23.5 0 top
R1  15.75,63 0 top
R2  16.5,65.25 270 top
R3  16.5,68.5 270 top
R4  54.25,39.25 90 top
R5  55.5,39.25 90 top
R6  93.25,48 270 top
R7  92.75,56.75 90 top
R8  92.75,70 90 top
R9  92.75,83.25 90 top
R10  78.75,7.25 90 top
R11  78.75,21 90 top
R12  78.75,34.75 90 top
R13  68.25,77.25 270 top
R14  59.5,80.75 0 top
R15  47.25,35.5 0 top
R16  45.25,34.25 0 top
R17  11,76.25 0 top
R18  11,78 180 top
R19  31.25,69.5 270 top
R20  29.75,69.5 90 top
R21  34.5,76.75 180 top
R22  73,10.25 180 top
R23  22.25,8.25 270 top
R24  32.5,28.25 270 top
R25  31.25,28.25 90 top
R26  35.75,31 0 top
R27  35.75,32.5 0 top
R28  34.25,34.75 270 top
R29  22,32.5 180 top
RM1  64,34.25 180 top
S1  96.5,46 90 top
S2  86.75,7.25 0 top
S3  86.75,21 0 top
S4  86.75,34.75 0 top
SB1  48.25,48.25 0 top
SB2  55.5,54.5 180 top
SB3  38.25,39.25 270 top
TP1  21.75,65.5 0 top
TP2  22,59 0 top
TP3  63.5,55.75 0 top
TP4  63.25,75 0 top
TP5  72.5,75 0 top
TP6  63.25,71.75 0 top
TP7  74.9,21.25 0 top
TP8  71.15,21.25 0 top
TP9  37.75,36.25 0 top
TP10  19.25,40.5 0 top
TP11  23.25,30.25 0 top
TP12  18.5,32.5 0 top
U1  13.5,65.5 180 top
U2  19,61.5 180 top
U3  63.5,45 180 top
U4  59.25,57.25 0 top
U5  55.75,74.5 90 top
U6  71,79 270 top
U7  59.5,75.5 270 top
U8  46.75,40 270 top
U9  14.75,78.5 270 top
U10  THDV1450  [SOIC8']  34.5,72 90 top
U11  73,15 270 top
U12  31,32.5 90 top
X1  73.5,43.5 270 top

### Tracks (layer width: path | path; a pad name or v marks a point on that pad's centre or on a via)
+1.8V
  Top 0.25: U7.6 U7.7
  pour Top (no thermals): 57.5,77 56.25,77 56.25,75 57.75,75 59.25,73.5 59.25,72 59.75,72 59.75,73.5 60.25,74 63.75,74 64.25,74.5 64.25,75.5 63.75,76 58.5,76
+3V  (via drill 0.3)
  Top 0.3: U3.28 61.75,52.35 C12.1
  Bottom 1: R9.P$1 90.5,78.5 90.5,69.75 R8.P$1 90.5,65.25 90.5,56.5 90.88,56.12 | R7.P$1 90.88,56.12 | 90.88,56.12 65.12,56.12 v63.5,54.5
  pour Top (no thermals): 59.75,56.5 62.75,56.5 63,56.75 64,56.75 64.25,56.5 64.25,54 63.5,53.25 61.75,53.25 61.75,52.5 61.5,52.25 61,52.25 61,54.5 59.75,55.75
+3V3  (via drill 0.3)
  Top 0.2: R10.2 v78.75,19.25 | R11.2 v78.75,23 v78.75,33 | v78.75,37.25 R12.2 | U9.6 13.3,79.55 U9.7 12.6,79.25 C26.1 10.45,79.85 C25.2 9.35,79.65 v9.2,79.5 | R18.2 10.35,77.77 v11,77.11 | U2.5 19.95,58.8 C5.2 21.6,58.6 TP2.1 | 73.75,78.25 C23.1 | U3.32 58.25,50.75 57.25,51.75 C14.1 56.15,50.45 C13.2 | 68,39 68.25,38.75 C16.1 C17.1 | R6.2 93.15,47.25 v92.25,47.25
  Top 0.3: U3.16 69.65,48.75 C15.1 70.35,49.75 v69.25,49.75 | C16.1 68.85,39.75 69.25,40.15 U3.1 | U3.64 67.25,38.5 68.25,37.5 C17.1 | v56.5,41 56.5,40.15 C18.1 56.85,40 57.5,40 57.75,40.25 U3.48 | U6.12 73.65,78.85 73.75,78.75 73.75,78.25 | R13.2 68.15,76.5 v67.25,76.5 | R19.2 v31.25,67.75 | R16.2 45.97,34.18 v45.97,32.75 | C24.2 57.9,70.25
  Top 0.5: U11.5 71.05,12.35 C30.1 68.15,12.35 67.12,13.38 66.88,13.38 | 66.88,13.38 v66.5,13.75 66,13.75 v65.75,13.5 65.88,13.38 66.88,13.38 | C28.1 31.25,75.25 | 31.25,75.25 v31.25,75.75 v30.5,75.75 30.75,75.75 31.25,75.25 | C28.1 31.25,75 | C23.1 73.85,78 v74.75,78 | C28.1 32.41,74.65 U10.8
  Bottom 0.2: v78.75,19.25 v78.75,23 | v78.75,33 v78.75,37.25 73.75,42.25 v67.5,42.25 | v92.25,47.25 91.5,46.5 v67.5,46.5
  Bottom 0.3: v69.25,49.75 67.25,49.75 v66.5,49
  Bottom 0.5: v9.2,79.5 11,79.5 | 11,79.5 19.25,79.5 23,75.75 v30.5,75.75 | J4.1 50.75,84.75 50.25,85.25 39.5,85.25 36.25,82 34,82 31.25,79.25 v31.25,75.75 | v74.75,78 68.75,78 v67.25,76.5 67.25,72.75 63.5,69 v59,69 | v11,77.11 11,79.5
  other vias: 53.75,53.5 55,55.75 54,55.75 59.75,48.25 60.75,48.25 60.25,47.5 60.5,41.75 61.5,41.75 61,41 58,51 59,51 58.5,50.25 52.75,35.75 53.5,35.25 53.5,36.25 58,69 58.5,68.25
  pour Top (no thermals): 8,59.25 6,57.25 6,55.5 9.25,55.5 11.75,58 23.5,58 23.5,60.5 18.75,60.5 18.75,59.5 18.5,59.25
  pour Top (no thermals): 56,74 58,74 58.5,73.5 58.5,69.75 58.75,69.5 59.25,69.5 59.25,68.5 58.5,67.75 57.5,67.75 57.5,71.25 56.75,72 56,72
  pour Top (no thermals): 55.75,49.75 59.75,49.75 59.75,51.25 59.5,51.5 57.5,51.5 56.5,52.5 55.75,52.5 55.25,53 55.25,55 55.75,55.5 58.75,55.5 58.75,56.75 54.25,56.75 53.25,55.75 53.25,53.5 54.25,52.5 55.25,52.5 55.75,52
  pour Bottom (no thermals): 55.5,55.25 55.5,64.75 59.25,68.5 59.25,69.5 56.25,69.5 47,60.25 34,60.25 32,62.25 32,77.25 31.38,77.88 29.25,75.75 29.25,68.5 21.25,60.5 21.25,58 48.5,58 53.5,53 54.75,53 54.75,54.5
  pour Top: 59.25,48.75 59.25,47.5 59.75,47 59.75,45 59.25,44.5 59.25,42.75 59.75,42.25 59.75,41.25 60.5,40.5 65.75,40.5 66.5,41.25 67.25,41.25 67.75,40.75 67.75,38.75 68,38.5 68.25,38.5 68.25,47 67,48.25 67,49.5 64.25,49.5 63.5,48.75 63.5,48 62.75,47.25 62.25,47.25 61.75,47.75 61.75,48.5 61.5,48.75
  pour Bottom: 60,47 60.5,47 61.25,47.75 61.25,48.75 59.75,50.25 59.75,51 59.25,51.5 57.75,51.5 57.5,51.25 57.5,49.5
  pour Bottom (no thermals): 58.25,40.5 61.25,40.5 62,41.25 62,42 61.5,42.5 55,42.5 45.25,32.75 45.25,31.75 45.5,31.5 47.75,31.5 47.75,15.25 42.25,9.75 38,9.75 35.5,7.25 35.5,5.75 37.25,5.75 37.25,7 37.5,7.25 37.5,7.5 38.25,8.25 46.75,8.25 47.75,7.25 47.75,5.75 49.75,5.75 49.75,7 53,10.25 63.5,10.25 67,13.75 67,14.5 66,15.5 50.75,15.5 49.5,16.75 49.5,29.75 56.75,37 56.75,39
  pour Top (no thermals): 53.5,39.25 48.75,39.25 48.5,39 48.5,38.5 48.5,36.75 47.75,36 47.75,35.5 47.75,30 48,29.75 49.5,29.75 54,34.25 54,37 53.5,37.5
+5V  (via drill 0.3)
  Top 0.5: U1.2 15.72,65.17 R2.2 18.35,64.4 C2.1 | C2.1 19.05,64.5 v20.25,64.5 | v72.25,16.25 72.36,16.36 U11.3 72.35,17.71 C29.1 | C2.1 21.05,64.8 TP1.1 | C2.1 19.45,65.5 v20.25,65.5
  Top 1: 21.75,64.75 TP1.1 | R23.1 21.25,9.35 | 21.25,9.35 20.65,9.35 v20.5,9.5 | 21.25,9.35 20.65,8.75 v20.5,8.75
  Bottom 1: TP1.1 v20.25,65.5 13.5,65.5 10.27,65.5 1.52,56.75 1.52,8.75 8.75,1.52 20.5,1.52 | 20.5,1.52 60,1.52 62.25,3.77 62.25,7.75 70.75,16.25 v72.25,16.25 | v20.5,9.5 v20.5,8.75 20.5,1.52
  pour Top (no thermals): 17.25,65 16,65 15.75,65.25 15.5,65.25 15.75,65 15.75,64.25 16,64 16,62.75 22.25,62.75 22.25,65.75 20.25,65.75 20,65.5 17.75,65.5
  pour Bottom (no thermals): 0.5,56.5 0.5,8.5 8.5,0.5 20.75,0.5 20.75,10 19.5,11.25 9.25,11.25 2.5,18 2.5,22 1.75,22.75 1.75,53.25 10.75,62.25 17,62.25 18.5,63.75 22.25,63.75 22.5,64 22.5,65.75 22.25,66 10,66
  pour Top: 22,66.25 21.5,66.25 21.25,66 21,65.75 20,65.75 19.75,65.5 17.75,65.5 17.25,65 16.5,65 16,65 15.75,65.25 14.75,65.25 14.75,65 15.5,65 15.75,64.75 15.75,62.75 16.25,62.75 17.25,62.75 17.5,62.5 17.75,62.25 18.25,62.25 18.25,63.5 18.5,63.75 19.5,63.75 19.75,63.5 19.75,63.25 19.75,62.25 20.25,62.25 20.75,62.75 22.25,62.75 22.5,63 22.5,65.75
ACS_ADC
  Top 0.25: U3.12 70.71,46.75 72.5,48.54 TP5.1
  Top 0.3: TP5.1 72.5,78.3 U6.11
ACS_IP+
  pour Top (no thermals): 71.25,79.85 71.25,88 75.75,88 75.75,82.5 73.1,79.85
ACS_IP-
  pour Top (no thermals): 70.75,79.85 70.75,88 66.25,88 66.25,82.5 68.9,79.85
BMS_NFAULT
  Top 0.25: U3.19 66.25,57.5 58.25,65.5 51.88,65.5 45,72.38 45,73.19 JP1.4 42.75,77.06 J4.5
BMS_WAKEUP
  Top 0.25: U3.18 66.75,57.71 58.46,66 52.09,66 45.5,72.59 45.5,75.23 JP1.3 44.75,76.52 J4.4
BUTTON1
  Top 0.2: 77.75,6.75 76.75,7.75 76.75,36 71,41.75 U3.2
  Top 0.25: S2.1 80.54,4.75 S2.2 80,5.21 80,6.5 | C20.1 80,6.5 | 80,6.5 78.85,6.5 R10.1 77.9,6.6 77.75,6.75
BUTTON2
  Top 0.2: 77.75,20.5 77.1,21.15 77.1,36.15 71,42.25 U3.3
  Top 0.25: S3.1 92.96,18.46 S3.2 80,18.96 80,20.25 | 80,20.25 C21.1 | 80,20.25 78.85,20.25 R11.1 77.9,20.35 77.75,20.5
BUTTON3
  Top 0.2: R12.1 77.9,34.1 77.45,34.55 77.45,36.29 71,42.75 U3.4
  Top 0.25: S4.2 80.43,32.21 80.47,32.25 | S4.1 80.47,32.25 | 80.47,32.25 80,32.72 C22.1 R12.1
CAN_RX  (1 unrouted)
  Top 0.2: U3.61 65.75,37.54 72.75,30.54 72.75,22.9 71.09,21.25 | TP8.1 71.09,21.3
  Top 0.25: U11.4 71.09,21.25
CAN_STB
  Top 0.2: U3.60 65.25,37.34 72.25,30.34 72.25,24.75 69.5,22 69.5,17.25 72.75,14 74.16,14 74.91,13.25 U11.8
CAN_TX
  Top 0.2: U3.62 66.25,37.75 73.25,30.75 73.25,22.9 TP7.1
  Top 0.25: U11.1 TP7.1
CANH
  Top 0.5: U11.7 73.64,10.56 R22.1 74,10.2 J13.2 74,5.5 73.5,5 68.75,5 J12.2
CANL
  Top 0.5: U11.6 72.36,10.56 R22.2 | J13.1 72,9.9 72.05,9.95 R22.2 | R22.2 69,10.25 J12.1
CP_WAKEUP
  Top 0.25: SB1.1 45.75,48.25 18.25,75.75 15.25,75.75 14.5,76.5 U9.13
DRV_IN1  (1 unrouted)
  Top 0.2: U3.40 40.25,45.25 31.25,36.25 31.25,34.5
DRV_IN2
  Top 0.2: U3.41 40.5,44.75 31.75,36 31.75,34.5 U12.14
DRV_NFAULT  (via drill 0.3)
  Top 0.2: U12.9 33.85,32.25 R26.1 35.69,30.41 v35.69,29.94 | U3.35 55.59,47.75 54.59,46.75 39.29,46.75 v36.27,43.73
  Bottom 0.2: v36.27,43.73 36.27,43.09 36.61,42.75 36.61,30.86 v35.69,29.94
DRV_NSLEEP  (via drill 0.3)
  Top 0.2: U3.37 56,46.75 55,45.75 41,45.75 40.75,45.75 40,45.75 32.55,38.3 v32.45,38.3 | v32.55,35.95 32.25,35.64 U12.13
  Bottom 0.2: v32.45,38.3 32.55,38.2 v32.55,35.95
DRV_SNSOUT  (via drill 0.3)
  Top 0.2: U12.10 34.85,32.75 R27.1 35.1,32.6 v36,33.5 | U3.36 55.79,47.25 54.79,46.25 39.64,46.25 v35.95,42.55
  Bottom 0.2: v35.95,42.55 35.95,33.55 v36,33.5
DRV_SO  (via drill 0.3)
  Top 0.2: U3.26 62.75,50 63,49.75 63,48.5 v62.5,48 | v52.75,44.14 40.89,44.14 38.25,41.5 SB3.1
  Bottom 0.2: v52.75,44.14 58.64,44.14 v62.5,48
GH1
  Top 0.2: U12.17 30.25,35.5 27,38.75 11,38.75 10.73,39.02 Q1.4
GH2  (via drill 0.3)
  Top 0.2: v19.5,26 22.75,26 28,31.25 U12.24 | v11.25,20.5 10.73,21.02 Q4.4
  Bottom 0.2: v11.25,20.5 16.75,26 v19.5,26
GL1
  Top 0.2: Q2.4 26.09,37.41 29.1,34.4 U12.19
GL2  (via drill 0.3)
  Top 0.2: Q3.4 16.25,31.43 v16.25,32.3 | U12.22 28.25,32.25 25.25,35.25 21.36,35.25 v21.25,35.14
  Bottom 0.2: v21.25,35.14 18.89,35.14 16.25,32.5 v16.25,32.3
GND  (via drill 0.3)
  Top 0.2: U9.21 15,78.75 U9.3 15,80.5 16.12,81.62 D6.1 | U12.25 30.75,32.75 U12.16 v30.75,37 | U12.20 v30.25,33.25 U12.25 | U12.5 v31.75,31.75 U12.25 | C10.1 58.65,55 v59.25,55 | U8.7 47.5,37.75 v47.5,39.14 | v23.75,33 23.6,33 R29.1 23.25,32.5 v23.75,32 | U9.12 v14,74.75 | U12.25 v31.75,33.25 | U12.25 v30.25,31.75 | v14.25,67.5 13.5,66.75 U1.9 13,66 v13,67.5
  Top 0.25: X1.2 v75.25,43.5 | C15.2 v70.5,52 | C16.2 71.25,38.75 | C17.2 71.25,37.5 | C20.2 80,9.25 S2.4 | C22.2 80,36.75 S4.4 | S1.4 S1.3 | U9.15 15.5,78 15,78.5 U9.21 14,77.75 U9.12
  Top 0.3: U3.15 v70.5,48.25 | U3.63 v66.75,40.5 | v62.25,49.5 U3.27 62.25,52.35 C12.2 | v24,10.25 24.23,10.03 D8.1 24.23,9.72 v24.75,10.25 | C18.2 56.9,38.75 v57.75,38.75 | C23.2 73.9,76.75 v74.75,76.75 | v59.25,55 U4.3 | U2.2 19,62 19.6,61.4 C3.1 | U3.47 58.75,41.75 59,41.5 v59,38.75 | S1.4 97.86,48.79 C19.2 | v59.89,51.89 60.25,51.54 U3.31
  Top 0.5: v73.5,20.5 73.65,20.35 C29.2 73.65,17.71 U11.2 | D7.3 v34.5,79.75
  other vias: 70.25,28.75 56.25,29 62,1.5 63.5,3 22.75,34 23.75,34 17.5,82.25 17.5,81.5 12.5,82.5 11.75,82.5 66,75.5 66,73.5 65,72.25 68.5,75 68.5,72.5 66.5,70.25 71.5,65 71.25,76.25 71.5,70.75 71,62.5 66.5,66.75 61.5,71 59.5,71 60.25,68 55.5,70.25 53.25,68 55.5,71.25 54.75,70.75 51.25,76 66,77 24.75,34 24.75,33 24.75,32 25.75,33 25.75,32 24.75,31 25.75,31 24.75,30 33.75,36.75 34.75,36.75 34.25,37.5 37.25,39.75 37.25,38 70.5,1.5 80,1.5 92,1.5 98.5,7.75 98.5,15 98.46,23.79 98.5,32.25 98.5,41.25 98.5,51.25 98.5,61.75 98.5,71.75 98.5,82 92,88.5 77,88.5 74.5,80 77,82.5 73.5,73.25 82.5,66.75 83,57.5 83,64.75 82.5,78.25 87,82.5 86,84 81,78.75 81,66.75 81,64.75 80.75,57.5 74.5,47.25 82.5,55 90.25,55 73.5,50.25 73.5,54.75 73.5,57.5 71,55 68.75,55 68.75,57.5 71,57.5 83,88.5 90.75,47.25 90.75,44.75 81.5,47.25 81.5,44.75 75.25,45.25 75.25,41.75 73.75,41 76.75,38 71,40.75 76,35.75 78.25,55 78.75,51.25 92,64.75 89,64.75 89,72.5 89,59.25 65.25,81.25 61.5,78.75 57.5,78.75 51.25,81.75 37.25,81 32.25,79 32.25,78 33,72.25 36.25,72.25 36.5,66.5 49.75,66 42.75,73 41.25,79.75 53.75,88.5 44.5,88.5 35.25,88.5 26.75,88.5 19.75,88.5 7.75,88.5 1.5,82.25 1.5,67 1.5,74 17.75,74.75 7.5,74.75 7,79.25 12.75,84.75 9.5,83 18.75,78.5 28.25,74.75 28.25,68.75 23.75,73 21.5,71 26,66.5 23.5,77 29,77 31.5,81.25 30,78 24.5,83.75 31,86.25 37,84.5 21.5,75.5 11,60.25 12,60.25 13,60.25 14,60.25 33,63.75 35.5,61.25 46.5,61.25 48.25,63 41.75,63 41.75,66 46.25,69.25 49.25,71.75 57.25,63 62.75,58 59.25,59.75 56.5,59 56.5,60 48,57 40,57 46.25,50.75 51.75,50.25 51.75,43.25 41.75,43.25 39.5,41.25 44.25,39.5 39.5,33.5 37.75,28.25 30.75,26 31.75,26 31.25,25.25 66.75,34 61,34 71,25.25 71,30 70.25,35 74.25,30 74.25,23.5 82.25,33 82.25,31.5 79.75,30 79.75,25 79.75,17 79.75,11.25 76,11.25 76,17 76,25 76,30 82.25,19.25 82.25,17.5 82.25,5.75 82.25,3.75 78.75,5.5 75.5,5 52.25,28.25 50.5,26.5 47,23 40.75,16.75 40.75,10.75 46.75,15.75 50.75,16.75 52.25,22.25 55.75,22.25 55.75,16.5 55.75,17.5 52.25,16.5 50.5,22.25 71,14.25 68.25,16.75 74,15.25 60.75,4.5 59.25,3 46,3 35.5,2.75 22,3.25 20,12 11.25,12.25 11.25,16 17.25,19.25 25,19.75 28.75,21.75 28.5,9.5 28.5,7 62,16.5 68,11.5 63.75,7.5 46.5,6.75 38.25,15.5 38.25,10.75 35,8 33.75,11 31.75,13 36.25,17.75 38.75,20 42.75,24 15.75,12.25 21,15.75 22.25,15.75 23.5,15.75 44.5,47.75 38.25,47.75 34.5,44 26.25,39.75 27.25,39.75 28,39.25 28.75,38.5 29.5,37.75 10,52 13.75,52 17.5,52 21.25,52 25,52 28.75,52 10,54.25 13.75,54.25 17.5,54.25 21.25,54.25 25,54.25 28.75,54.25 11,49.75 14,49.5 17.75,45.75 40.25,51.75 37.75,54.25 35.5,57 12.25,57 14,57 15.75,57 17.5,57 23.5,63.75 20.25,67.25 25.75,44.5 32.5,52 32.5,54.25 36.25,52 27,57 43,54 14.75,78.5 53,52.25 46.75,28.5
  pour Top (no thermals): 0.5,66.5 12.5,66.5 13,66 13,64.25 10.5,61.75 10.5,59.75 15.75,59.75 15.75,62 14.75,62 14.25,62.5 14.25,66.25 15,66.25 15.25,66.5 15.25,68 15.75,68.5 17.25,68.5 17.75,68 17.75,66.5 18,66.25 20.25,66.25 21,67 22,67 22.75,66.25 23,66.25 24.75,68 24.75,68.5 19.52,73.73 19.52,73.77 18.05,75.25 15,75.25 14,76.25 14,77 12.25,75.25 7.25,75.25 7.25,77.25 7.75,79.5 9,80.75 21.75,80.75 26.75,85.75 35.75,85.75 37,84.5 37,83.25 37.5,82.75 41.25,82.75 41.75,83.25 41.75,89.25 8,89.25 0.5,81.75
  pour Bottom (no thermals): 75.5,89.5 75.5,77.25 69,77.25 68,76.25 68,72.5 64,68.5 60,68.5 56,64.5 56,55.5 60.25,51.25 60.25,50.75 62.25,48.75 63.25,48.75 63.25,48 59,43.75 59,43.25 59.25,43 61.75,43 62.5,42.25 62.5,41 61.5,40 58.5,40 57.25,38.75 57.25,36.75 50,29.5 50,17 51,16 68.5,16 69.5,17 69.5,21.75 70.5,22.75 71.5,22.75 73,21.25 73,15.5 72.5,15 70.75,15 63.5,7.75 63.5,3.75 60.25,0.5 91.75,0.5 99.5,8.25 99.5,81.75 91.75,89.5
  pour Top (no thermals): 55.25,29.25 60.5,34.5 62,34.5 62,33 61,32 60.25,32 60,31.75 60,29.75 60.5,29.25 67.5,29.25 68,29.75 68,31.5 67.5,32 66.75,32 66,32.75 66,34.5 67.5,34.5 71.75,30.25 71.75,25 69,22.25 69,17 71.5,14.5 71.5,14.25 64.25,7 64.25,5 65,4.25 73.75,4.25 75.75,6.25 78,6.25 78,0.5 8.75,0.5 0.75,8.25 0.5,8.5 0.5,17.75 0.75,18 4,18 9,13 20,13 21,12 21,11.5 19.5,10 19.5,7.5 23.75,3.25 26.75,3.25 27,3.5 27,6.25 28.25,7.5 29.5,7.5 38.25,16.25 38.75,16.25 38.75,8 38.5,7.75 35.5,7.75 35.25,7.5 35.25,5.5 41,5.5 41.5,6 41.5,7 40.25,8.25 40.25,17 52,28.75 52.75,28.75 52.75,9.25 51.25,7.75 47.5,7.75 47.5,5.25 57.25,5.25 57.75,5.75 57.75,7 55.25,9.5
  pour Top (no thermals): 22.25,34.5 22.25,29.25 26.75,29.25 26.75,34.5
  pour Top (no thermals): 13.75,16.5 5.25,16.5 4.62,15.88 9.25,11.25 22.25,11.25 23.5,10 23.5,8.5 24.75,8.5 24.75,8.75 25.25,9.25 25.25,9.75 25.5,10 27,10 28,9 28.75,9 47.25,27.5 47.25,28.75 46.75,29.25 44,29.25 43.5,29.75 43.5,38 46,40.5 50.25,40.5 52.25,42.5 52.25,43.75 41.25,43.75 39,41.5 39,33.75 37.25,32 37.25,28.5 36.5,27.75 33.5,27.75 33.5,27 33.25,26.75 32,26.75 31.75,27 31.75,27.75 30.75,27.75 30.75,26.75 30,26 29,26 29,25 29.5,24.5 29.5,23.25 26.5,20.25 17.5,20.25
  pour Top: 58.5,79.25 58.5,77.5 58.75,77.25 60.25,77.25 60.5,77.5 60.5,79.25 61.75,79.25 64.25,81.75 66.25,81.75 68.75,79.25 69.75,79.25 69.75,78.75 68.5,78.75 66.25,76.5 58.5,76.5 57.5,77.5 56,77.5 55.5,77 55.5,71.75 56.25,71 57,71 57,67.5 52.75,67.5 47.62,72.62 50.75,75.75 50.75,82 52,83.25 52,84.25 51.25,85 40.75,85 40.75,89.25 54.25,89.25 54.25,82.25 57.25,79.25
  pour Top (no thermals): 8.5,55 8.5,52.5 7.25,51.25 6.25,51.25 5.75,50.75 5.75,49.75 6.25,49.25 13.5,49.25 18.5,44.25 25.25,44.25 25.75,43.75 25.75,39.25 27.25,39.25 30.25,36.25 30.75,36.25 32,37.5 32,37.75 31.75,38 31.75,38.5 35,41.75 35,43.75 38.5,47.25 45,47.25 45,48.25 35.75,57.5 12,57.5 9.5,55
  pour Top (no thermals): 57.75,55 57.75,54 59.25,54 59.5,53.75 60.5,53.75 60.5,54.25 59.75,55
  pour Top (no thermals): 76.5,89.5 76.5,82.5 74,80 74,79.75 75.5,78.25 75.5,77.75 74.75,77 73.5,77 73.25,76.75 73.25,76 73.75,75.5 73.75,74.5 73,73.75 73,49.75 73.25,49.5 73.5,49.5 81.25,57.25 81.25,54.5 73.75,47 73.75,45.5 74.5,45.5 74.75,45.25 74.75,42 74.25,41.5 71,41.5 69.75,40.25 69.75,34.75 73.75,30.75 73.75,23.25 74.75,22.25 75.5,22.25 76,21.75 76,20.75 75.5,20.25 75.5,0.5 91.75,0.5 99.5,8.25 99.5,81.75 91.75,89.5
  pour Top (no thermals): 23.75,57.25 35.75,57.25 35.75,57.5 24.25,69 24,69 23,68 23,62.75 22,61.75 19.5,61.75 19,62.25 18.5,61.75 15.25,61.75 15.25,61 23.75,61 24,60.75 24,57.5
  pour Top (no thermals): 55.25,49.75 55.25,51.75 55,52 54,52 52.75,53.25 52.75,56.25 53.75,57.25 62.75,57.25 63.25,57.75 57.5,63.5 35.5,63.5 31.75,67.25 31,67.25 30.5,67.75 30.5,71.25 34.75,71.25 34.75,73 32,73 31.75,73.25 31.75,73.75 30.75,73.75 30.5,74 30.5,75.25 30.75,75.5 31.5,75.5 32.5,76.5 32.5,81.5 32.25,81.75 26.75,81.75 25.25,83.25 25.25,84.5 20,84.5 17.5,82 17.5,79.25 18.25,78.5 18.25,78 46,50.25 51,50.25 51.5,49.75
  pour Bottom (no thermals): 78.5,89.5 78.5,81 76,78.5 68.5,78.5 66.5,76.5 66.5,73.25 63.25,70 56,70 46.75,60.75 34.25,60.75 32.5,62.5 32.5,77.5 32,78 32,79.75 33.5,81.25 36.5,81.25 40,84.75 41.5,84.75 41.75,84.5 41.75,83 42.25,82.5 51.25,82.5 51.75,83 51.75,89.5
  pour Bottom: 53.5,89.5 53.5,85 51.5,85 50.5,86 39.25,86 36,82.75 33.75,82.75 30.5,79.5 30.5,77.75 29.25,76.5 23.25,76.5 19.75,80 9.75,80 9.25,80.5 12,83.25 13.25,83.25 13.25,82.5 14,81.75 14,81 14.5,80.5 15,80.5 15.25,80.75 15.25,82.25 14.75,82.75 14.75,83.25 17,83.25 17.25,83 17.75,83 18.25,83.5 18.25,84 17.75,84.5 17.25,84.5 17,84.25 11.5,84.25 7.75,80.5 7.75,78.75 10,76.5 11.5,76.5 11.75,76.75 11.75,77.5 11.5,77.75 11.5,78.75 11.75,79 19,79 22.75,75.25 22.75,73.75 0.5,73.75 0.5,81.75 8.25,89.5
  pour Bottom: 0.5,75.25 0.5,66.5 21,66.5 21.25,66.75 22.25,66.75 23,66 23,64 22.25,63.25 18.5,63.25 17,61.75 11,61.75 7.75,58.5 7.75,54 8,53.75 42.25,53.75 49.5,46.5 58.25,46.5 59,47.25 59,47.5 57,49.5 57,51.25 55.75,52.5 53.25,52.5 48.25,57.5 21.25,57.5 20.75,58 20.75,60.5 28.75,68.5 28.75,75.25
  pour Top: 59,71.5 59,70 59.5,70 59.75,69.75 59.75,66.75 60.25,66.25 68.25,58.25 68.25,50.75 71.25,50.75 71.5,51 71.5,62.75 64.5,69.75 63.75,70.5 62.75,70.5 61.75,71.5
  pour Top (no thermals): 74,19.75 73.25,19.75 73.25,15.5 75.5,13.25 76,13.25 76,16.25 74.5,16.25 74,16.75
  pour Top: 66.25,76 65,76 64.75,75.75 64.75,74.25 64,73.5 64,72.75 64.5,72.25 64.5,71.25 71.75,64 72,64 72,73.75 71.25,74.5 71.25,75.5 72,76.25 72,76.75 71.75,77 69.25,77 69,76.75 69,76 68.75,75.75 66.5,75.75
  pour Bottom (no thermals): 6.25,51.25 5.75,50.75 5.75,49.75 6.25,49.25 10.5,49.25 10.75,49 10.75,12 11,11.75 19.75,11.75 21.5,10 21.5,3 22,2.5 59.5,2.5 61.25,4.25 61.25,7 60.5,7.75 58.5,7.75 57.75,7 57.75,6 57,5.25 47.5,5.25 47.25,5.5 47.25,7 46.5,7.75 42.25,7.75 41.5,7 41.5,6 41,5.5 37.75,5.5 37.5,5.25 35.25,5.25 35,5.5 35,7.25 38,10.25 42,10.25 47.25,15.5 47.25,28.75 46.75,29.25 44,29.25 43.5,29.75 43.5,31 44.75,32.25 44.75,33 54.75,43 60.25,43 60.25,43.75 53.25,43.75 53,43.5 52.25,43.5 52,43.75 52,44.5 52.25,44.75 53,44.75 53.25,44.5 58,44.5 58.25,44.75 58.25,45.25 58,45.5 48.75,45.5 41.75,52.5 8.5,52.5 7.25,51.25
  pour Top (no thermals): 33.25,36.75 37,40.5 37.5,40.5 37.5,37.75 36.5,36.75 36.5,36 35.5,35 33.5,35 33.25,35.25
  pour Top: 33.25,73 33.25,71 37.25,71 37.25,68.5 36,67.25 36,66 36.5,65.5 50.25,65.5 50.62,65.88 40.75,75.75 40.75,76.75 41.75,77.75 41.75,84.75 36.75,84.75 36.75,76 36.25,75.5 36.25,73.5 35.75,73
  pour Bottom: 54.75,52.5 55.25,53 55.25,54.5 58.12,57.38 63.5,52 57.5,52 56.75,51.25 56,51.25
I2C2_SCL
  Top 0.2: U3.43 54.57,43.75 50.57,39.75 46.37,39.75 46.12,39.5 U8.6
  Top 0.25: U8.6 46.12,35.98 R15.1 46.6,30.6 J8.2
I2C2_SDA
  Top 0.2: U3.42 54.5,44.25 50.4,40.15 46.15,40.15 44.84,38.84 U8.5 44.84,34.49 R16.1 44.5,34.15 J8.3
INA_ADC
  Top 0.25: U3.13 70.5,47.25 72,48.75 72,63 TP6.1 62.4,72.6 U7.8
LED1
  Top 0.25: U3.59 64.75,36.75 65.2,36.3 RM1.1
LED2
  Top 0.25: RM1.2 64.4,36.53 64.25,36.68 U3.58
LED3
  Top 0.25: RM1.3 63.6,36.53 63.75,36.68 U3.57
LED4
  Top 0.25: U3.56 63.25,36.75 62.8,36.3 RM1.4
MOTOR_ENCODER1  (via drill 0.3)
  Top 0.2: U3.38 58.75,46.25 58.93,46.43 v59,46.43
  Bottom 0.2: v59,46.43 58.75,46.43 58.5,46.18 49.32,46.18 42.07,53.43 7.57,53.43 J3.2
MOTOR_ENCODER2  (via drill 0.3)  (1 unrouted)
  Top 0.2: U3.39 58.75,45.75 58.93,45.57 v59,45.57
  Bottom 0.2: v59,45.57 58.75,45.57 58.5,45.82 49.18,45.82 42.75,52.25 | 42.75,52.25 41.93,53.07 7.57,53.07 J3.3
N$1  (via drill 0.3)
  Top 0.2: U9.4 14.5,80.86 v14.68,81.04
  Top 0.25: J9.D+1 14.5,85 14.07,84.58 D6.3 14,83.69 v14,82.75
  Bottom 0.2: v14.68,81.04 14.68,82.07 v14,82.75
N$2
  Top 0.25: RM1.5 62.8,32.63 D4.+
N$3
  Top 0.25: SB1.2 U3.34
N$4
  Top 0.2: C4.1 18.05,60.25 U2.4
N$5
  Top 0.25: J9.D-1 15.15,82.92 D6.4 14,81.77 U9.5
N$6  (via drill 0.3)
  Top 0.2: U9.8 9.4,78.75 C27.1 8.65,78.85 v8.5,79
  Top 0.25: J9.VBUS1 15.8,84.08 D6.2 16.14,83.75 v17.5,83.75
  Bottom 0.2: v17.5,83.75 11.75,83.75 8.5,80.5 v8.5,79
N$7
  Top 0.2: U9.11 12.5,76.25 R17.2
N$8
  Top 0.2: R18.1 11.9,78.25 U9.9
N$9
  Top 0.25: RM1.6 63.6,32.35 63,31.75 D3.+
N$10
  Top 0.2: R17.1 D5.+
N$11
  Top 0.2: 24.45,7.07 24.26,7.26 | R23.2 22.36,7.26
  Top 0.3: J14.VBUS1 24.45,7.07 | 24.26,7.26 D8.2 22.39,7.29 R23.2
N$12
  Top 0.2: R4.2 54.25,40.75 56.25,42.75 U3.45
N$13
  Top 0.2: R5.2 55.5,41.5 56.25,42.25 U3.46
N$14
  Top 0.25: D2.+ 65,31.75 64.4,32.35 RM1.7
N$15
  Top 0.25: 66.82,30.83 D1.+ 65.25,32.58 65.25,33.4 RM1.8
N$16
  Top 0.25: X1.1 73,44.7 72.05,43.75 U3.6
N$17
  Top 0.25: X1.3 72.95,42.3 72,43.25 U3.5
N$18
  Top 0.25: S1.2 94.59,46 | 94.59,46 S1.1 | 94.59,46 73.25,46 71.5,44.25 U3.7
  Top 0.3: C19.1 95.14,48.79 S1.2 93.39,48.79 R6.1
N$19
  Top 0.5: J11.2 33.5,82.5 | 33.5,82.5 33.5,80.9 D7.2 R21.2 33.87,76.44 U10.7 | 33.5,82.5 27.75,82.5 J10.2
N$20
  Top 0.5: U10.6 35.13,76.44 R21.1 D7.1 35.5,80.9 J11.1 34.25,85 29.75,85 J10.1
N$21
  Top 0.3: U1.3 16.23,65.83 R2.1 R3.2
N$22
  Top 0.3: U1.1 14.9,64.1 15.1,63.9 R1.1
N$23
  Top 0.3: U6.6 68.7,78.35 R13.1
N$24
  Top 0.2: U12.3 30.75,30.05 29.5,28.8 C33.1
N$25
  Top 0.25: U7.2 59.83,79.97 R14.2
  pour Top (no thermals): 60,80 61.75,80 64.25,82.5 64.25,88.25 60,88.25
N$28
  Top 0.25: U7.3 59.17,79.97 R14.1
  pour Top (no thermals): 59,80 59,88.25 54.75,88.25 54.75,82.5 57.25,80
N$29
  Top 0.2: U12.11 34.75,33.25 TP9.1 38.25,36.75 SB3.2
N$32
  Top 0.2: C33.2 29.6,27.35 30.5,28.25 30.5,29.31 31.25,30.06 U12.4
N$33
  Top 0.2: U12.2 30.25,30.05 29.97,29.78 28.68,29.78 C34.2
N$34
  Top 0.2: R25.2 R24.1 32.5,29.75 32.25,30 U12.6
N$35
  Top 0.2: U12.7 32.9,30.75 34,29.65 C35.2 32.75,27.6 R24.2
N$36
  Top 0.2: R27.2 R26.2 36.4,29.65 35.75,29 C36.2 34,30.6 34,31.25 33.5,31.75 U12.8
N$37
  Top 0.2: U12.12 33.9,33.75 R28.2
POT_1
  Top 0.25: U3.9 71.41,45.25 82.91,56.75 R7.P$2
POT_2
  Top 0.25: U3.10 71.21,45.75 82.25,56.79 82.25,65.25 87,70 R8.P$2
POT_3
  Top 0.25: U3.11 71,46.25 81.75,57 81.75,78.5 86.5,83.25 R9.P$2
RS_485_RD  (via drill 0.3)
  Top 0.2: U3.24 63.75,52.91 64.79,53.96 64.79,56.96 57.75,64 35.84,64 33.5,66.34 v33.5,66.75
  Top 0.25: U10.2 33.87,70.89 33.75,71 30,71 29.75,70.75 R20.2
  Top 0.3: U10.3 U10.2 33.87,68.64 v34.5,68 35.13,68.64 U10.3
  Bottom 0.2: v33.5,66.75 33.5,67 v34.5,68
SH1
  Top 0.2: U12.18 29.75,35.25 26.75,38.25 8.5,38.25 8.25,38 8.25,37.5 8.35,37.41 Q2.5
  pour Top (no thermals): 14.25,33.25 1.75,33.25 1.75,42.5 3.25,44 11.5,44 11.5,40.5 9.75,40.5 9.5,40.25 9.5,38.25 10,37.75 14.25,37.75
SH2
  Top 0.2: U12.23 27.75,31.75 22.75,26.75 10.75,26.75 10.63,26.87 Q3.8
  pour Top (no thermals): 14.5,31.75 1.75,31.75 1.75,23.25 2.5,22.5 11.5,22.5 11.5,25.75 12.75,27 14.5,27
SP
  Top 0.2: U12.21 28.5,32.75 25.5,35.75 20.25,35.75 18.5,34 TP12.1
  pour Top (no thermals): 15.5,36.5 15.5,33.5 15.5,33.25 15.5,33 16.75,33 17,32.75 17.25,32.5 17.25,30.75 17,30.5 15.5,30.5 15.5,27 17.75,27 21.5,30.75 21.5,34 19,36.5
SPI3_MISO
  Top 0.25: U3.53 61.75,37.79 53.75,29.79 53.75,7.5 J5.3
SPI3_MOSI
  Top 0.25: U3.54 62.25,37.59 54.25,29.59 54.25,7 J5.4
SPI3_SCK
  Top 0.25: U3.52 61.25,38 53.25,30 53.25,9 J5.2
SPI3_USER_CS
  Top 0.25: U3.55 62.75,37.38 54.75,29.38 54.75,8.5 J5.5
SWCLK
  Top 0.25: U3.50 60.25,37.79 39.75,17.29 39.75,7.25 J2.3
SWDIO
  Top 0.25: U3.49 59.75,38 39.25,17.5 39.25,7.25 J2.2
USART1_RX
  Top 0.2: U3.23 64.25,52.71 65.29,53.75 65.29,57.16 57.96,64.5 36.04,64.5 34.25,66.29 34.25,67.09 32.59,68.75 U10.1
  Top 0.25: R19.1 32.6,70.15 32.75,70 32.75,69.69 U10.1
USART1_TX
  Top 0.2: U3.22 64.75,52.5 65.79,53.54 65.79,57.37 58.16,65 36.25,65 34.75,66.5 34.75,67.09 36.41,68.75 U10.4
USART2_RX
  Top 0.25: U3.17 67.25,57.91 58.66,66.5 52.29,66.5 46,72.79 46,75.23 JP1.2 46.75,76.52 J4.3
USART2_TX
  Top 0.25: U3.14 68.25,47.75 67.75,48.25 67.75,58.12 58.87,67 52.5,67 46.5,73 46.5,73.19 JP1.1 48.75,77.06 J4.2
USART3_RX  (via drill 0.3)
  Top 0.25: U3.33 51.04,48.75 50.54,49.25 45.54,49.25 18.04,76.75 v17.25,76.75 | v17.25,78.38 17.12,78.25 U9.18
  Bottom 0.25: v17.25,76.75 v17.25,78.38
USART3_TX
  Top 0.25: U3.30 60.75,49.75 60.25,49.25 51.25,49.25 50.75,49.75 45.75,49.75 17.75,77.75 U9.17
USB_DM
  Top 0.2: J14.D-1 25.1,6.85 25.25,7 25.25,8.5 25.96,9.21 D8.4
  Top 0.25: R4.1 54.5,38.35 54.5,34 29,8.5 26.98,8.5 D8.4
USB_DP
  Top 0.2: J14.D+1 25.75,6.76 D8.3
  Top 0.25: R5.1 55.25,38.35 55.25,34.18 29.17,8.1 27.08,8.1 D8.3
VDD  (via drill 0.3)
  Top 0.2: U12.1 28.09,30.6 26.75,29.26 26.75,28.15 C34.1
  other vias: 5.5,45.5 6.75,45.5 8,45.5 9.25,45.5 9.25,46.75 8,46.75 6.75,46.75 5.5,46.75 5.5,48 6.75,48 8,48 9.25,48 5.5,20.75 6.75,20.75 8,20.75 9.25,20.75 5.5,19.5 6.75,19.5 8,19.5 5.5,18.25 6.75,18.25 8,18.25 9.25,18.25 9.25,19.5
  pour Top (no thermals): 12.1,65.9 0.5,65.9 0.5,47.5 3.25,44.75 12,44.75 12.5,44.25 12.5,39.25 25.25,39.25 25.25,43.5 25,43.75 18.25,43.75 13.25,48.75 6,48.75 5.25,49.5 5.25,57.25 12.1,64.1
  pour Top (no thermals): 12.5,25.75 12.5,21 11.5,20 10.75,20 9.25,21.5 4.75,21.5 4.75,18 5.75,17 13.5,17 17.5,21 26.25,21 28.5,23.25 28.5,28 25.5,28 22.75,25.25 19,25.25 18.5,25.75
  pour Bottom: 10.25,48.75 10.25,17 5.75,17 5,17.75 5,48.5 5.25,48.75
VDDA
  Top 0.3: U3.29 61.25,51.75 61,52 60.88,52 60.87,52 60.75,52 60,52.75 C11.1
  pour Top (no thermals): 55.75,54.75 55.75,53 56.75,53 57.25,52.5 60.5,52.5 60.5,53.25 59,53.25 58.75,53.5 57.5,53.5 57,54 57,54.75

### Text on the board
tPlace: USB-\UART | GND | nFlt | WKP | RX | TX | 3.3V | RS-485 | BMS | User potentiometers | Current / sense | STM32 / practice / board | 3.3V | MCU | Encoder_2 | Encoder_1 | GND | Reset | Dc Motor / Driver | EEPROM | GND | SDA | SCL | 3.3V | User buttons | ST-Link | SPI (3) | CAN-FD | USB | 3.3V | SWDIO | SWCLK | GND | 3.3V | SCK | MISO | MOSI | CS | GND
bPlace: B | A | B | A | CANL | CANH | CANL | CANH
Document: U11